# EAGLE design csa_netusb-v2.0b (EAGLE 5.11)

## Sheet 1 of 3
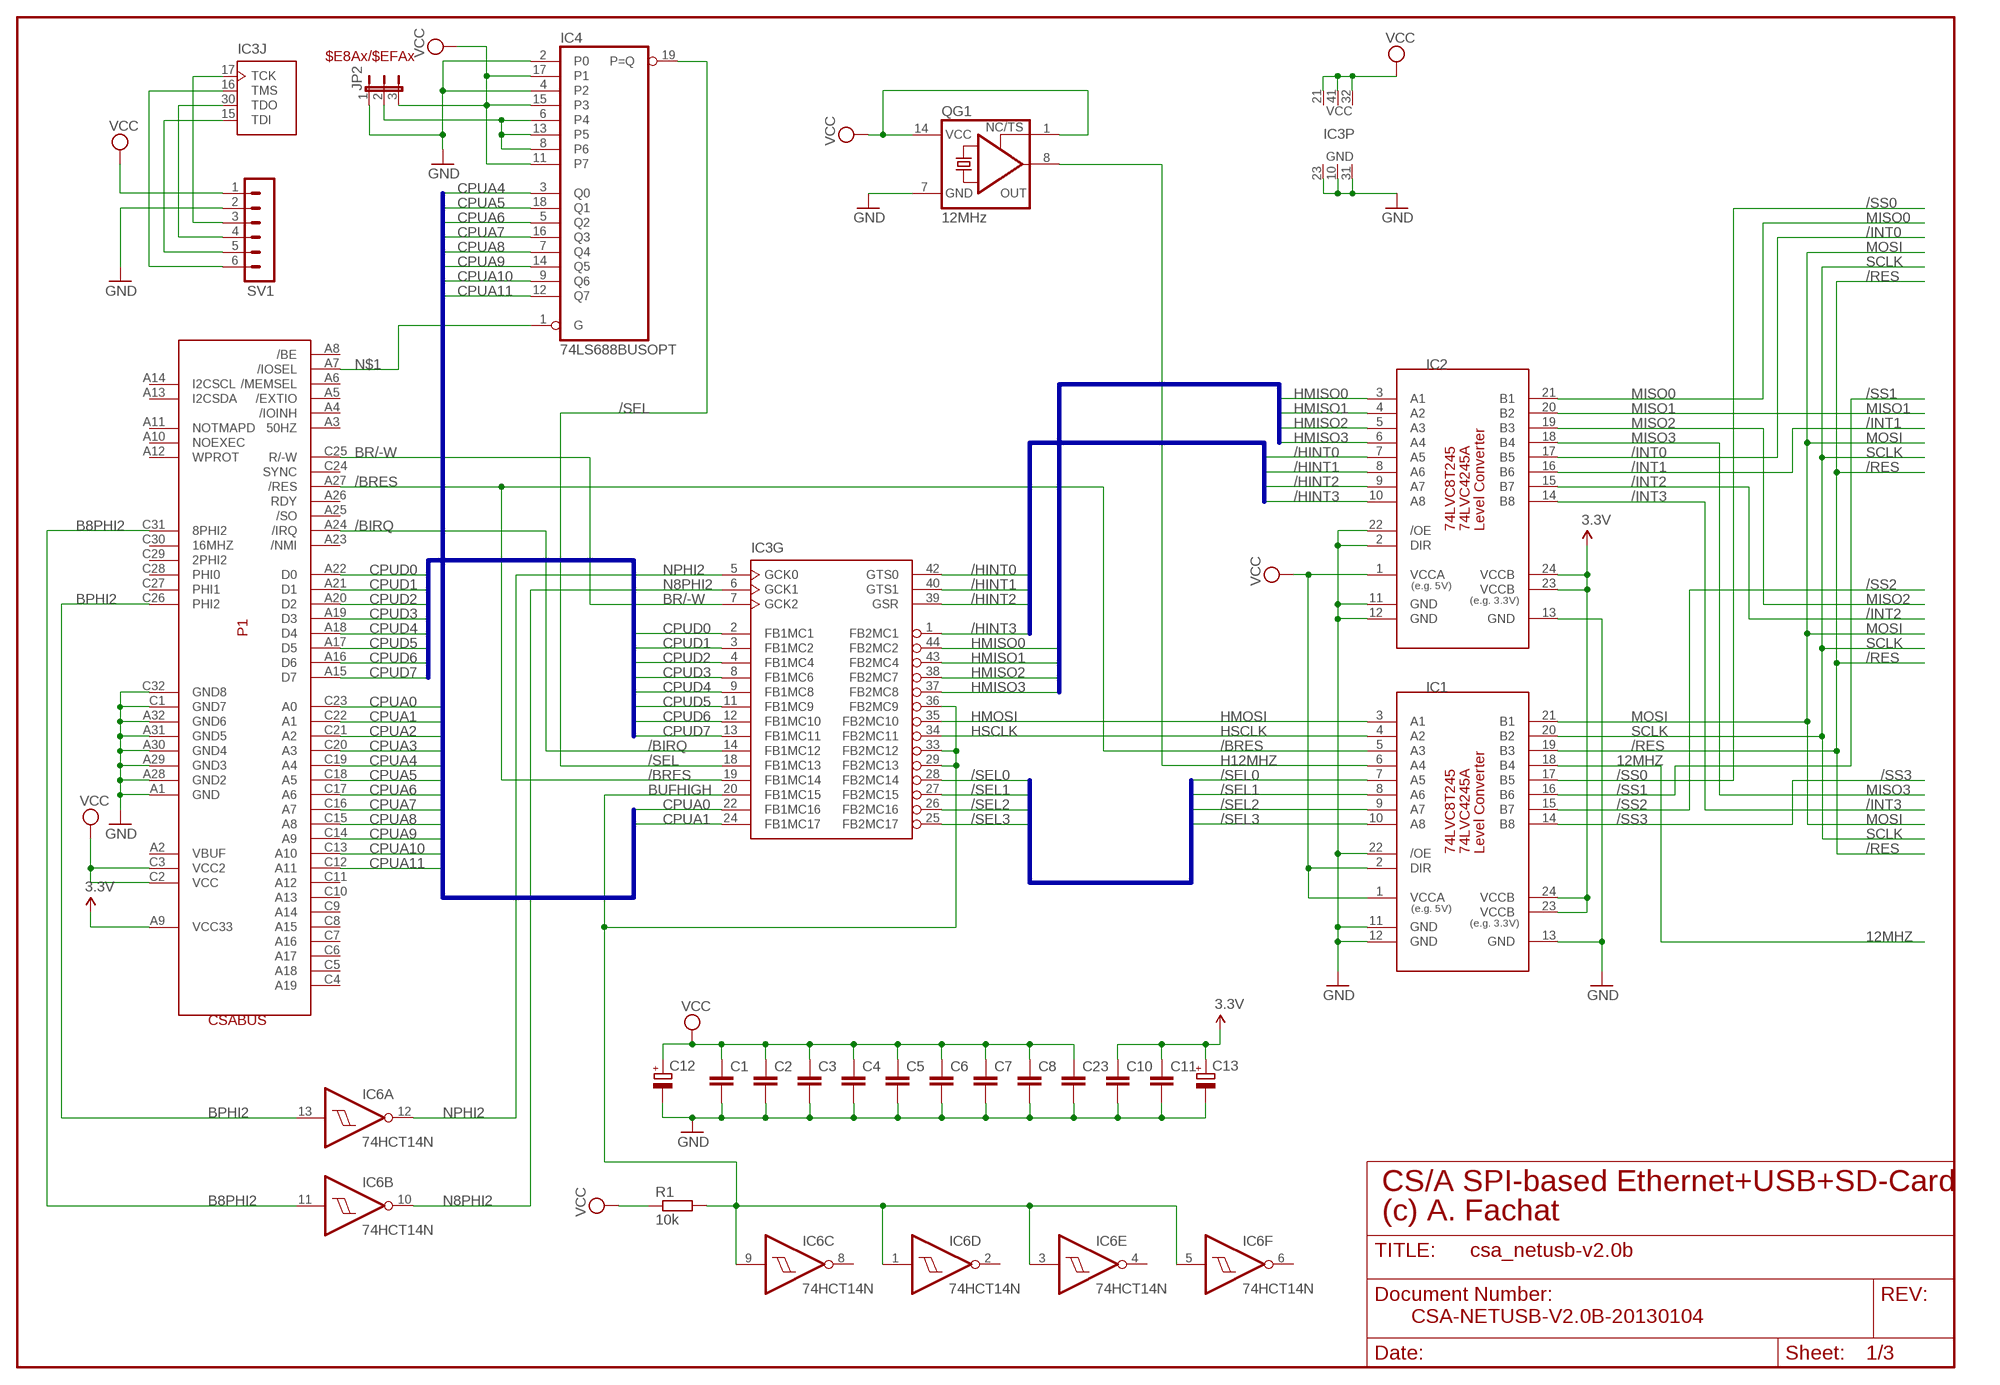
[diagram p0: schematic, sheet 1]

### Parts
C1  C-EU050-025X075  [C050-025X075]
C2  C-EU050-025X075  [C050-025X075]
C3  C-EU050-025X075  [C050-025X075]
C4  C-EU050-025X075  [C050-025X075]
C5  C-EU050-025X075  [C050-025X075]
C6  C-EU050-025X075  [C050-025X075]
C7  C-EU050-025X075  [C050-025X075]
C8  C-EU050-025X075  [C050-025X075]
C10  C-EU050-025X075  [C050-025X075]
C11  C-EU050-025X075  [C050-025X075]
C12  CPOL-EUE3.5-8  [E3,5-8]
C13  CPOL-EUE3.5-8  [E3,5-8]
C23  C-EU050-025X075  [C050-025X075]
IC1  74LVC8T245SO24  [SO24L]
IC2  74LVC8T245SO24  [SO24L]
IC3  XC9536-44  [PLCC-S44]
IC4  74LS688BUSOPT  [DIL20]
IC6  74HCT14N  [DIL14]
JP2  JP2E  [JP2]
P1  CSABUS  [CSABUS]
QG1  12MHz  XO-14  [DIL14S]
R1  10k  R-EU_0204/7  [0204/7]
SV1  MA06-1  [MA06-1]

### Nets
3.3V: C10.1 C11.1 C13.+ IC1.23(VCCB) IC1.24(VCCB) IC2.23(VCCB) IC2.24(VCCB) P1.A9(VCC33) ; also sheet 2,3
12MHZ: IC1.18(B4) ; also sheet 3
/BIRQ: IC3.14(G:FB1MC12) P1.A24(/IRQ)
/BRES: IC1.5(A3) IC3.19(G:FB1MC14) P1.A27(/RES)
/HINT0: IC2.7(A5) IC3.42(G:GTS0)
/HINT1: IC2.8(A6) IC3.40(G:GTS1)
/HINT2: IC2.9(A7) IC3.39(G:GSR)
/HINT3: IC2.10(A8) IC3.1(G:FB2MC1)
/INT0: IC2.17(B5) ; also sheet 2
/INT1: IC2.16(B6)
/INT2: IC2.15(B7) ; also sheet 3
/INT3: IC2.14(B8) ; also sheet 3
/RES: IC1.19(B3) ; also sheet 2,3
/SEL: IC3.18(G:FB1MC13) IC4.19(P=Q)
/SEL0: IC1.7(A5) IC3.28(G:FB2MC14)
/SEL1: IC1.8(A6) IC3.27(G:FB2MC15)
/SEL2: IC1.9(A7) IC3.26(G:FB2MC16)
/SEL3: IC1.10(A8) IC3.25(G:FB2MC17)
/SS0: IC1.17(B5) ; also sheet 2
/SS1: IC1.16(B6) ; also sheet 2
/SS2: IC1.15(B7) ; also sheet 3
/SS3: IC1.14(B8) ; also sheet 3
B8PHI2: IC6.11(B:I) P1.C31(8PHI2)
BPHI2: IC6.13(A:I) P1.C26(PHI2)
BR/-W: IC3.7(G:GCK2) P1.C25(R/-W)
BUFHIGH: IC3.20(G:FB1MC15) IC3.29(G:FB2MC13) IC3.33(G:FB2MC12) IC3.36(G:FB2MC9) IC6.1(D:I) IC6.3(E:I) IC6.5(F:I) IC6.9(C:I) R1.2
CPUA0: IC3.22(G:FB1MC16) P1.C23(A0)
CPUA1: IC3.24(G:FB1MC17) P1.C22(A1)
CPUA2: P1.C21(A2)
CPUA3: P1.C20(A3)
CPUA4: IC4.3(Q0) P1.C19(A4)
CPUA5: IC4.18(Q1) P1.C18(A5)
CPUA6: IC4.5(Q2) P1.C17(A6)
CPUA7: IC4.16(Q3) P1.C16(A7)
CPUA8: IC4.7(Q4) P1.C15(A8)
CPUA9: IC4.14(Q5) P1.C14(A9)
CPUA10: IC4.9(Q6) P1.C13(A10)
CPUA11: IC4.12(Q7) P1.C12(A11)
CPUD0: IC3.2(G:FB1MC1) P1.A22(D0)
CPUD1: IC3.3(G:FB1MC2) P1.A21(D1)
CPUD2: IC3.4(G:FB1MC4) P1.A20(D2)
CPUD3: IC3.8(G:FB1MC6) P1.A19(D3)
CPUD4: IC3.9(G:FB1MC8) P1.A18(D4)
CPUD5: IC3.11(G:FB1MC9) P1.A17(D5)
CPUD6: IC3.12(G:FB1MC10) P1.A16(D6)
CPUD7: IC3.13(G:FB1MC11) P1.A15(D7)
GND: C1.2 C2.2 C3.2 C4.2 C5.2 C6.2 C7.2 C8.2 C10.2 C11.2 C12.- C13.- C23.2 IC1.11(GND) IC1.12(GND) IC1.13(GND) IC1.22(/OE) IC2.2(DIR) IC2.11(GND) IC2.12(GND) IC2.13(GND) IC2.22(/OE) IC3.10(P:GND) IC3.23(P:GND) IC3.31(P:GND) IC4.2(P0) IC4.4(P2) JP2.1 P1.A1(GND) P1.A28(GND2) P1.A29(GND3) P1.A30(GND4) P1.A31(GND5) P1.A32(GND6) P1.C1(GND7) P1.C32(GND8) QG1.7(GND) SV1.2 ; also sheet 2,3
H12MHZ: IC1.6(A4) QG1.8(OUT)
HMISO0: IC2.3(A1) IC3.44(G:FB2MC2)
HMISO1: IC2.4(A2) IC3.43(G:FB2MC4)
HMISO2: IC2.5(A3) IC3.38(G:FB2MC7)
HMISO3: IC2.6(A4) IC3.37(G:FB2MC8)
HMOSI: IC1.3(A1) IC3.35(G:FB2MC10)
HSCLK: IC1.4(A2) IC3.34(G:FB2MC11)
MISO0: IC2.21(B1) ; also sheet 2
MISO1: IC2.20(B2) ; also sheet 2
MISO2: IC2.19(B3) ; also sheet 3
MISO3: IC2.18(B4) ; also sheet 3
MOSI: IC1.21(B1) ; also sheet 2,3
N8PHI2: IC3.6(G:GCK1) IC6.10(B:O)
N$1: IC4.1(G) P1.A7(/IOSEL)
N$15: IC4.6(P4) IC4.8(P6) IC4.13(P5) JP2.2
NPHI2: IC3.5(G:GCK0) IC6.12(A:O)
SCLK: IC1.20(B2) ; also sheet 2,3
TCK: IC3.17(J:TCK) SV1.3
TDI: IC3.15(J:TDI) SV1.5
TDO: IC3.30(J:TDO) SV1.4
TMS: IC3.16(J:TMS) SV1.6
VCC: C1.1 C2.1 C3.1 C4.1 C5.1 C6.1 C7.1 C8.1 C12.+ C23.1 IC1.1(VCCA) IC1.2(DIR) IC2.1(VCCA) IC3.21(P:VCC) IC3.32(P:VCC) IC3.41(P:VCC) IC4.11(P7) IC4.15(P3) IC4.17(P1) JP2.3 P1.C2(VCC) P1.C3(VCC2) QG1.1(TS) QG1.14(VCC) R1.1 SV1.1 ; also sheet 3
Unconnected: IC6.2(D:O) IC6.4(E:O) IC6.6(F:O) IC6.8(C:O) P1.A2(VBUF) P1.A3(50HZ) P1.A4(/IOINH) P1.A5(/EXTIO) P1.A6(/MEMSEL) P1.A8(/BE) P1.A10(NOEXEC) P1.A11(NOTMAPD) P1.A12(WPROT) P1.A13(I2CSDA) P1.A14(I2CSCL) P1.A23(/NMI) P1.A25(/SO) P1.A26(RDY) P1.C4(A19) P1.C5(A18) P1.C6(A17) P1.C7(A16) P1.C8(A15) P1.C9(A14) P1.C10(A13) P1.C11(A12) P1.C24(SYNC) P1.C27(PHI1) P1.C28(PHI0) P1.C29(2PHI2) P1.C30(16MHZ)

### Buses
HMISO[0..3]
/HINT[0..3]
/SEL[0..3]
CPUA[0..11]
CPUD[0..7]

### Notes on the sheet
- $E8Ax/$EFAx
- CS/A SPI-based Ethernet+USB+SD-Card
- (c) A. Fachat
- CSA-NETUSB-V2.0B-20130104

## Sheet 2 of 3
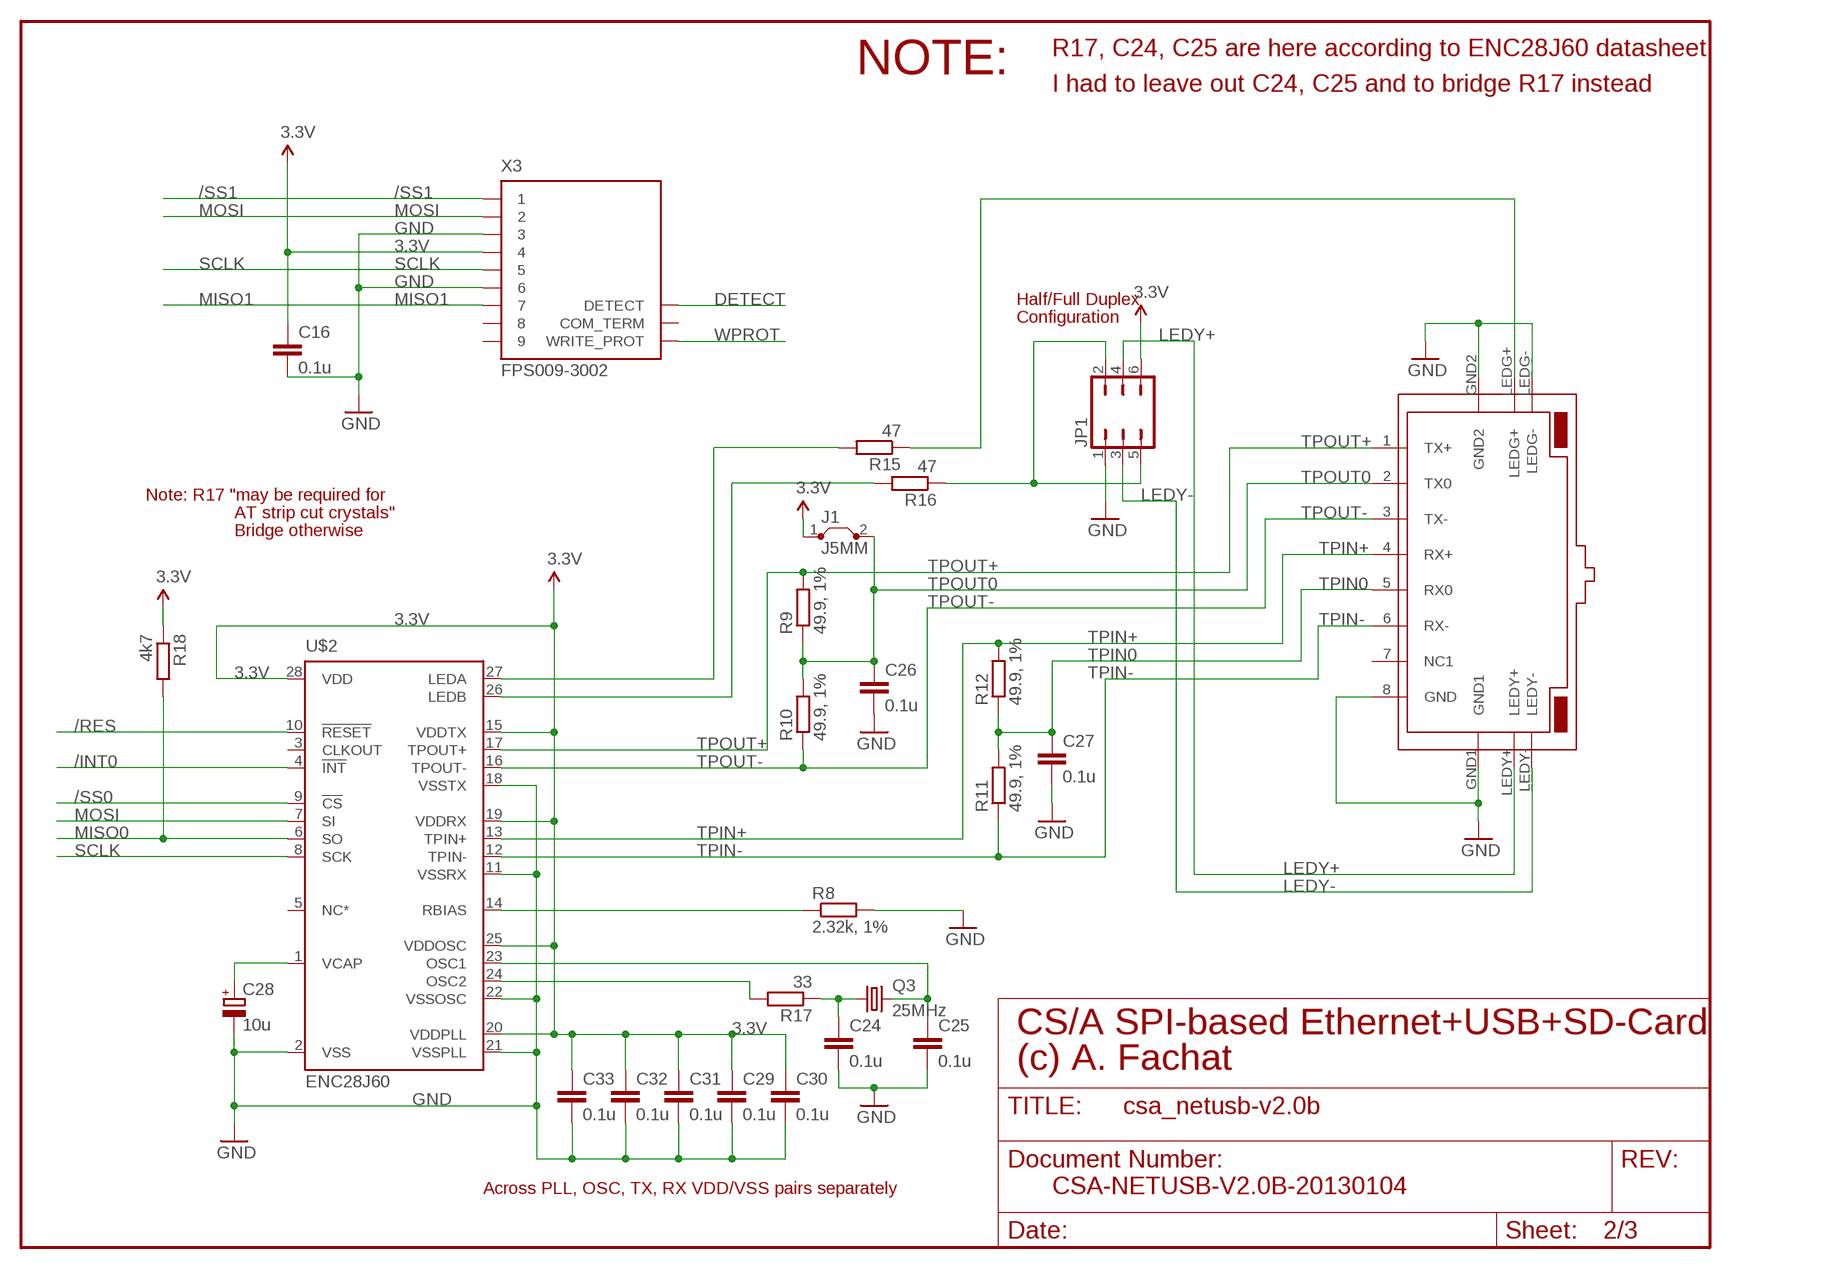
[diagram p1: schematic, sheet 2]

### Parts
C16  0.1u  C-EU050-025X075  [C050-025X075]
C24  0.1u  C-EU050-025X075  [C050-025X075]
C25  0.1u  C-EU050-025X075  [C050-025X075]
C26  0.1u  C-EU050-025X075  [C050-025X075]
C27  0.1u  C-EU050-025X075  [C050-025X075]
C28  10u  CPOL-EUE2-5  [E2-5]
C29  0.1u  C-EU050-025X075  [C050-025X075]
C30  0.1u  C-EU050-025X075  [C050-025X075]
C31  0.1u  C-EU025-025X050  [C025-025X050]
C32  0.1u  C-EU025-025X050  [C025-025X050]
C33  0.1u  C-EU025-025X050  [C025-025X050]
J1  J5MM  [05]
JP1  JP3Q  [JP3Q]
Q3  25MHz  CRYSTALHC49S  [HC49/S]
R8  2.32k, 1%  R-EU_0204/5  [0204/5]
R9  49.9, 1%  R-EU_0204/5  [0204/5]
R10  49.9, 1%  R-EU_0204/5  [0204/5]
R11  49.9, 1%  R-EU_0204/5  [0204/5]
R12  49.9, 1%  R-EU_0204/5  [0204/5]
R15  47  R-EU_0204/5  [0204/5]
R16  47  R-EU_0204/5  [0204/5]
R17  33  R-EU_0204/5  [0204/5]
R18  4k7  R-EU_0204/5  [0204/5]
U$2  ENC28J60  [DIP28-3]
U$3  RJ45-TRAFO-L  [RJ45-TRAFO-L]
X3  FPS009-3002  [FPS009-3000]

### Nets
3.3V: C16.1 C29.1 C30.1 C31.1 C32.1 C33.1 J1.1 JP1.6 R18.1 U$2.15(VDDTX) U$2.19(VDDRX) U$2.20(VDDPLL) U$2.25(VDDOSC) U$2.28(VDD) X3.4 ; also sheet 1,3
/INT0: U$2.4(!INT) ; also sheet 1
/RES: U$2.10(!RESET) ; also sheet 1,3
/SS0: U$2.9(!CS) ; also sheet 1
/SS1: X3.1 ; also sheet 1
DETECT: X3.DETECT ; also sheet 3
GND: C16.2 C24.2 C25.2 C26.2 C27.2 C28.- C29.2 C30.2 C31.2 C32.2 C33.2 JP1.1 R8.2 U$2.2(VSS) U$2.11(VSSRX) U$2.18(VSSTX) U$2.21(VSSPLL) U$2.22(VSSOSC) U$3.8(GND) U$3.GND1 U$3.GND2 U$3.LEDG- X3.3 X3.6 ; also sheet 1,3
LEDY+: JP1.4 U$3.LEDY+
LEDY-: JP1.3 U$3.LEDY-
MISO0: R18.2 U$2.6(SO) ; also sheet 1
MISO1: X3.7 ; also sheet 1
MOSI: U$2.7(SI) X3.2 ; also sheet 1,3
N$17: R15.2 U$2.27(LEDA)
N$18: R16.2 U$2.26(LEDB)
N$19: JP1.2 JP1.5 R16.1
N$20: C25.1 Q3.2 U$2.23(OSC1)
N$21: R17.2 U$2.24(OSC2)
N$22: C24.1 Q3.1 R17.1
N$23: R8.1 U$2.14(RBIAS)
N$30: C28.+ U$2.1(VCAP)
N$31: R15.1 U$3.LEDG+
SCLK: U$2.8(SCK) X3.5 ; also sheet 1,3
TPIN0: C27.1 R11.2 R12.1 U$3.5(RX0)
TPIN+: R12.2 U$2.13(TPIN+) U$3.4(RX+)
TPIN-: R11.1 U$2.12(TPIN-) U$3.6(RX-)
TPOUT0: C26.1 J1.2 R9.1 R10.2 U$3.2(TX0)
TPOUT+: R9.2 U$2.17(TPOUT+) U$3.1(TX+)
TPOUT-: R10.1 U$2.16(TPOUT-) U$3.3(TX-)
WPROT: X3.WRITE_PROT ; also sheet 3
Unconnected: U$2.3(CLKOUT) U$2.5(NC*) U$3.7(NC1) X3.8 X3.9 X3.COM_TERM

### Notes on the sheet
- R17, C24, C25 are here according to ENC28J60 datasheet
- NOTE:
- I had to leave out C24, C25 and to bridge R17 instead
- Half/Full Duplex
- Configuration
- Note: R17 "may be required for
- AT strip cut crystals"
- Bridge otherwise
- CS/A SPI-based Ethernet+USB+SD-Card
- (c) A. Fachat
- Across PLL, OSC, TX, RX VDD/VSS pairs separately | CSA-NETUSB-V2.0B-20130104

## Sheet 3 of 3
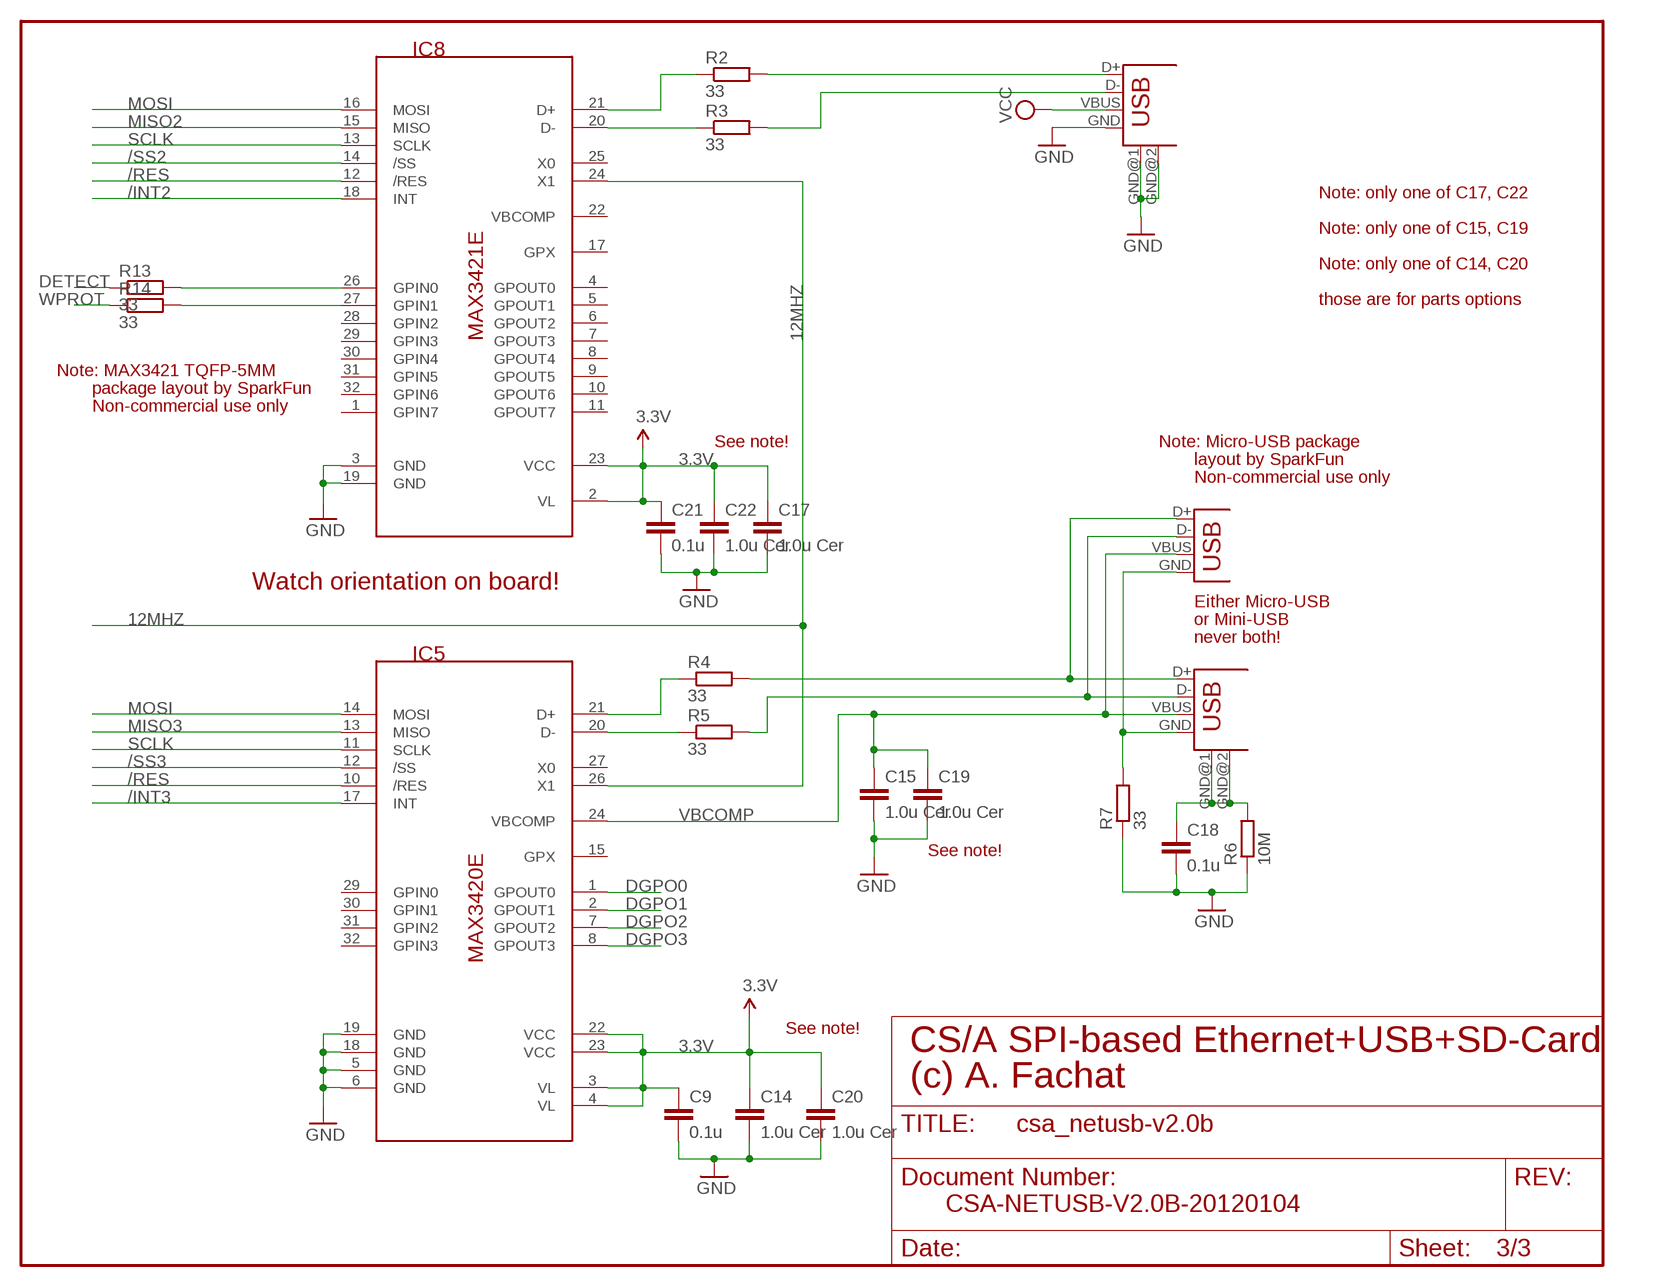
[diagram p2: schematic, sheet 3]

### Parts
C9  0.1u  C-EU050-025X075  [C050-025X075]
C14  1.0u Cer  C-EUC0603  [C0603]
C15  1.0u Cer  C-EUC0603  [C0603]
C17  1.0u Cer  C-EU050-024X044  [C050-024X044]
C18  0.1u  C-EU050-025X075  [C050-025X075]
C19  1.0u Cer  C-EU050-024X044  [C050-024X044]
C20  1.0u Cer  C-EU050-024X044  [C050-024X044]
C21  0.1u  C-EU050-025X075  [C050-025X075]
C22  1.0u Cer  C-EUC0603  [C0603]
IC5  MAX3420E  [LQFP32]
IC8  MAX3421E  [TQFP32-5MM]
R2  33  R-EU_0204/7  [0204/7]
R3  33  R-EU_0204/7  [0204/7]
R4  33  R-EU_0204/7  [0204/7]
R5  33  R-EU_0204/7  [0204/7]
R6  10M  R-EU_0204/7  [0204/7]
R7  33  R-EU_0204/7  [0204/7]
R13  33  R-EU_0204/7  [0204/7]
R14  33  R-EU_0204/7  [0204/7]
USB1  USB-A-H  [USB-A-H]
USB2  USB-MB-H  [USB-MB-H]
X1  USB-MICROB  [USB-MICROB]

### Nets
3.3V: C9.1 C14.1 C17.1 C20.1 C21.1 C22.1 IC5.3(VL) IC5.4(VL) IC5.22(VCC) IC5.23(VCC) IC8.2(VL) IC8.23(VCC) ; also sheet 1,2
12MHZ: IC5.26(X1) IC8.24(X1) ; also sheet 1
/INT2: IC8.18(INT) ; also sheet 1
/INT3: IC5.17(INT) ; also sheet 1
/RES: IC5.10(/RES) IC8.12(/RES) ; also sheet 1,2
/SS2: IC8.14(/SS) ; also sheet 1
/SS3: IC5.12(/SS) ; also sheet 1
DETECT: R13.1 ; also sheet 2
DGPO0: IC5.1(GPOUT0)
DGPO1: IC5.2(GPOUT1)
DGPO2: IC5.7(GPOUT2)
DGPO3: IC5.8(GPOUT3)
GND: C9.2 C14.2 C15.2 C17.2 C18.2 C19.2 C20.2 C21.2 C22.2 IC5.5(GND) IC5.6(GND) IC5.18(GND) IC5.19(GND) IC8.3(GND) IC8.19(GND) R6.1 R7.1 USB1.GND USB1.GND@1(GND) USB1.GND@2(GND) ; also sheet 1,2
MISO2: IC8.15(MISO) ; also sheet 1
MISO3: IC5.13(MISO) ; also sheet 1
MOSI: IC5.14(MOSI) IC8.16(MOSI) ; also sheet 1,2
N$3: IC8.20(D-) R3.1
N$4: IC8.21(D+) R2.1
N$5: IC5.20(D-) R5.1
N$6: IC5.21(D+) R4.1
N$7: R4.2 USB2.D+ X1.D+
N$8: R5.2 USB2.D- X1.D-
N$9: R2.2 USB1.D+
N$10: R3.2 USB1.D-
N$11: IC8.26(GPIN0) R13.2
N$13: R7.2 USB2.GND X1.GND
N$14: IC8.27(GPIN1) R14.2
N$16: C18.1 R6.2 USB2.GND@1(GND) USB2.GND@2(GND)
SCLK: IC5.11(SCLK) IC8.13(SCLK) ; also sheet 1,2
VBCOMP: C15.1 C19.1 IC5.24(VBCOMP) USB2.VBUS X1.VBUS
VCC: USB1.VBUS ; also sheet 1
WPROT: R14.1 ; also sheet 2
Unconnected: IC5.15(GPX) IC5.27(X0) IC5.29(GPIN0) IC5.30(GPIN1) IC5.31(GPIN2) IC5.32(GPIN3) IC8.1(GPIN7) IC8.4(GPOUT0) IC8.5(GPOUT1) IC8.6(GPOUT2) IC8.7(GPOUT3) IC8.8(GPOUT4) IC8.9(GPOUT5) IC8.10(GPOUT6) IC8.11(GPOUT7) IC8.17(GPX) IC8.22(VBCOMP) IC8.25(X0) IC8.28(GPIN2) IC8.29(GPIN3) IC8.30(GPIN4) IC8.31(GPIN5) IC8.32(GPIN6)

### Notes on the sheet
- Note: only one of C17, C22
- Note: only one of C15, C19
- Note: only one of C14, C20
- those are for parts options
- Note: MAX3421 TQFP-5MM
- package layout by SparkFun
- Non-commercial use only
- See note! | Note: Micro-USB package
- layout by SparkFun
- Non-commercial use only
- Watch orientation on board!
- Either Micro-USB
- or Mini-USB
- never both!
- See note!
- See note!
- CS/A SPI-based Ethernet+USB+SD-Card
- (c) A. Fachat
- CSA-NETUSB-V2.0B-20120104

## Power pins joined to a net without a drawn wire
GND: IC4.10(GND) IC6.7(P:GND)
VCC: IC4.20(VCC) IC6.14(P:VCC)

## Library data of the parts
C1-C11 C14-C27 C29-C33 = rcl:C-EU: CAPACITOR, European symbol
C12 C13 = resistor:CPOL-EU: POLARIZED CAPACITOR, European symbol
C28 = rcl:CPOL-EU: POLARIZED CAPACITOR, European symbol
IC1 IC2 = csa:74LVC8T245
IC3 = XILINX:XC9536-44
IC4 = csa:74LS688BUSOPT
IC5 = csa:MAX3420E
IC6 = 74xx-eu:74*14: Hex schmitt trigger INVERTER
IC8 = csa:MAX3421E
J1 = jumper:J: Bridge
JP1 = jumper:JP3Q: JUMPER
JP2 = jumper:JP2E: JUMPER
P1 = csa:CSABUS
Q3 = crystal:CRYSTAL: CRYSTAL; OC_FARNELL: 1667008; OC_NEWARK: unknown
QG1 = crystal:XO-: CRYSTAL; OC_FARNELL: unknown; OC_NEWARK: unknown
R1-R18 = rcl:R-EU_: RESISTOR, European symbol
SV1 = con-lstb:MA06-1: PIN HEADER
U$2 = csa:ENC28J60
U$3 = con-amphenol-rj45-ld:RJ45-TRAFO-L: RJ45 socket with integrated magnetics and LEDs Naming: Amphenol LMJ1998824110DL1T39J TME RJ45-TRAFO-L Author: Petr Kalandra <mailto:kalandrap@gmail.com> Datasheet: http://zefiryn.tme.pl/dok/zlacza/rjtrafol.PDF
USB1 USB2 = con-usb-2:USB: USB Connectors USB-B-PTH is fully proven SKU : PRT-00139 USB-miniB is fully proven SKU : PRT-00587 USB-A-PCB is untested. USB-A-H is throughly reviewed, but untested. Spark Fun Electronics SKU : PRT-00437 USB-B-SMT is throughly reviewed, but untested. Needs silkscreen touching up. USB-A-S has not been used/tested USB-MB-H has not been used/tested
X1 = SparkFun:USB: USB Connectors USB-B-PTH is fully proven SKU : PRT-00139 USB-miniB is fully proven SKU : PRT-00587 USB-A-PCB is untested. USB-A-H is throughly reviewed, but untested. Spark Fun Electronics SKU : PRT-00437 USB-B-SMT is throughly reviewed, but untested. Needs silkscreen touching up. USB-A-S has not been used/tested USB-MB-H has not been used/tested
X3 = con-yamaichi:FPS009-300*: SD Card and MMC Reader (Manual Insertion) Source: http://www.yamaichi.de/pdf/c_fps009_3000.pdf; OC_FARNELL: unknown; OC_NEWARK: unknown

## Board
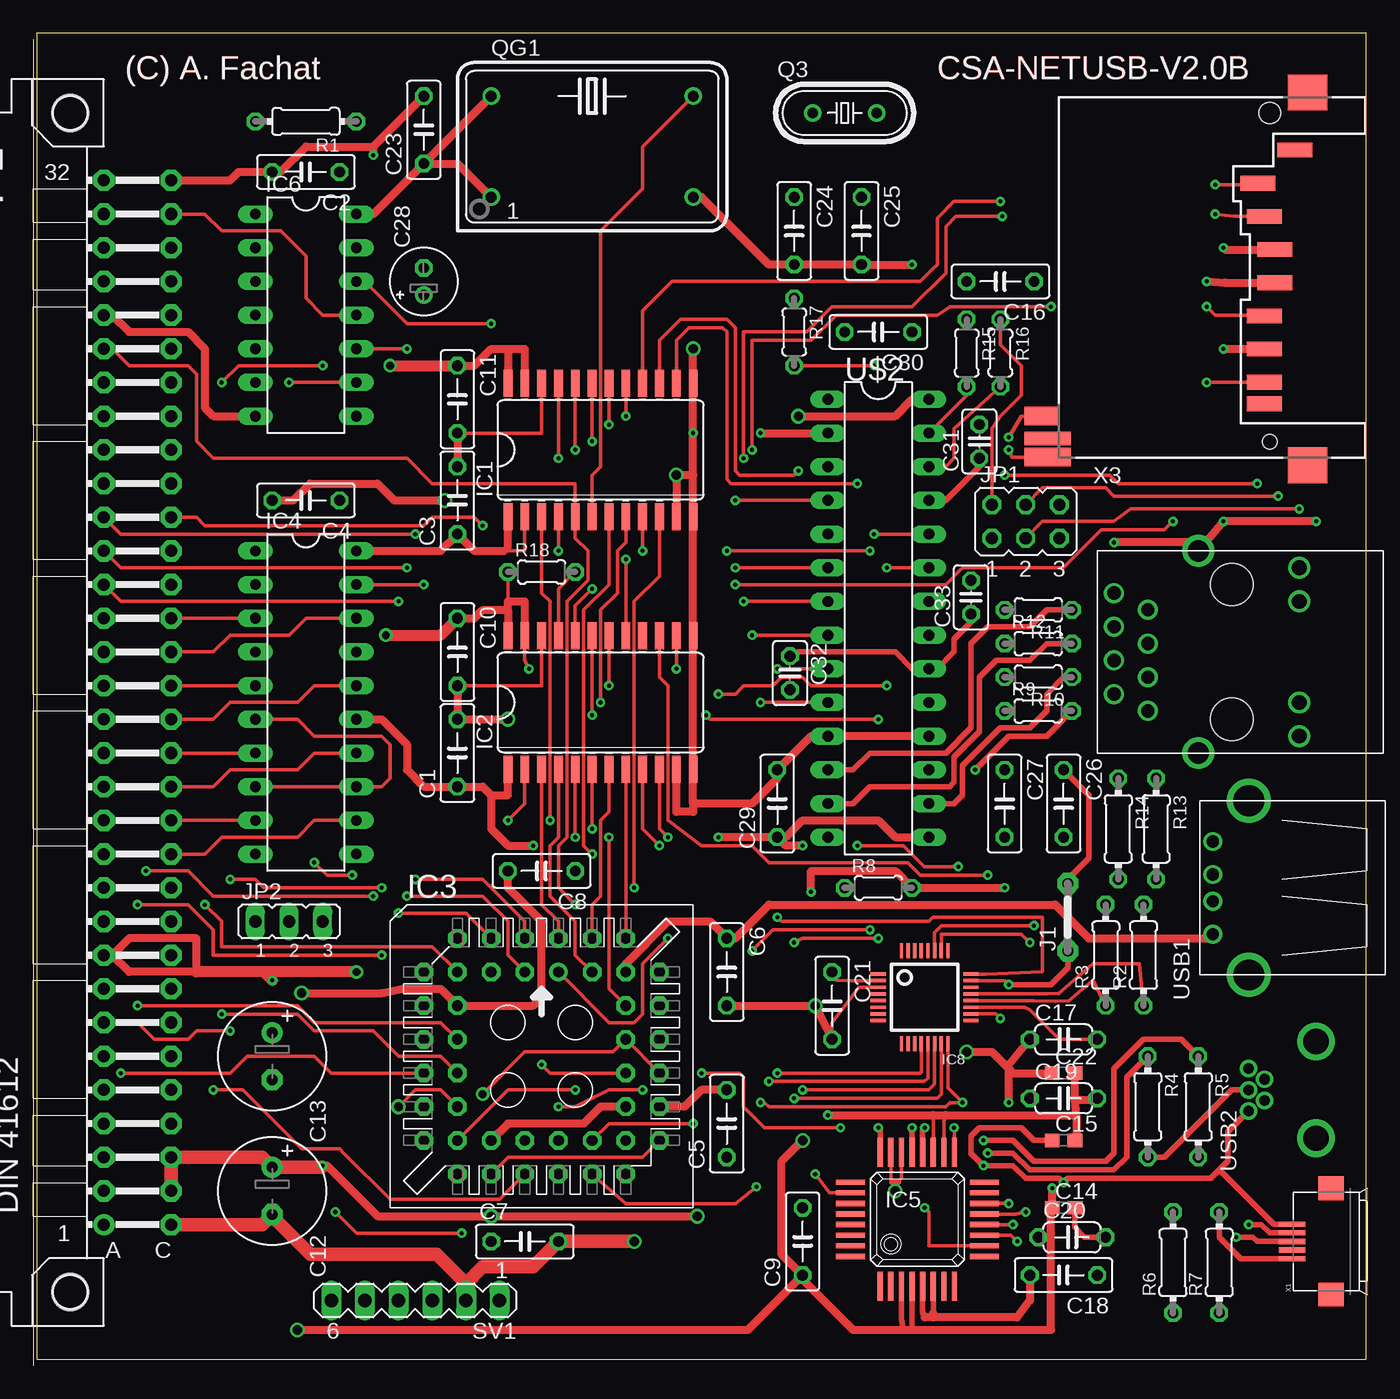
[diagram p3: board, top side]
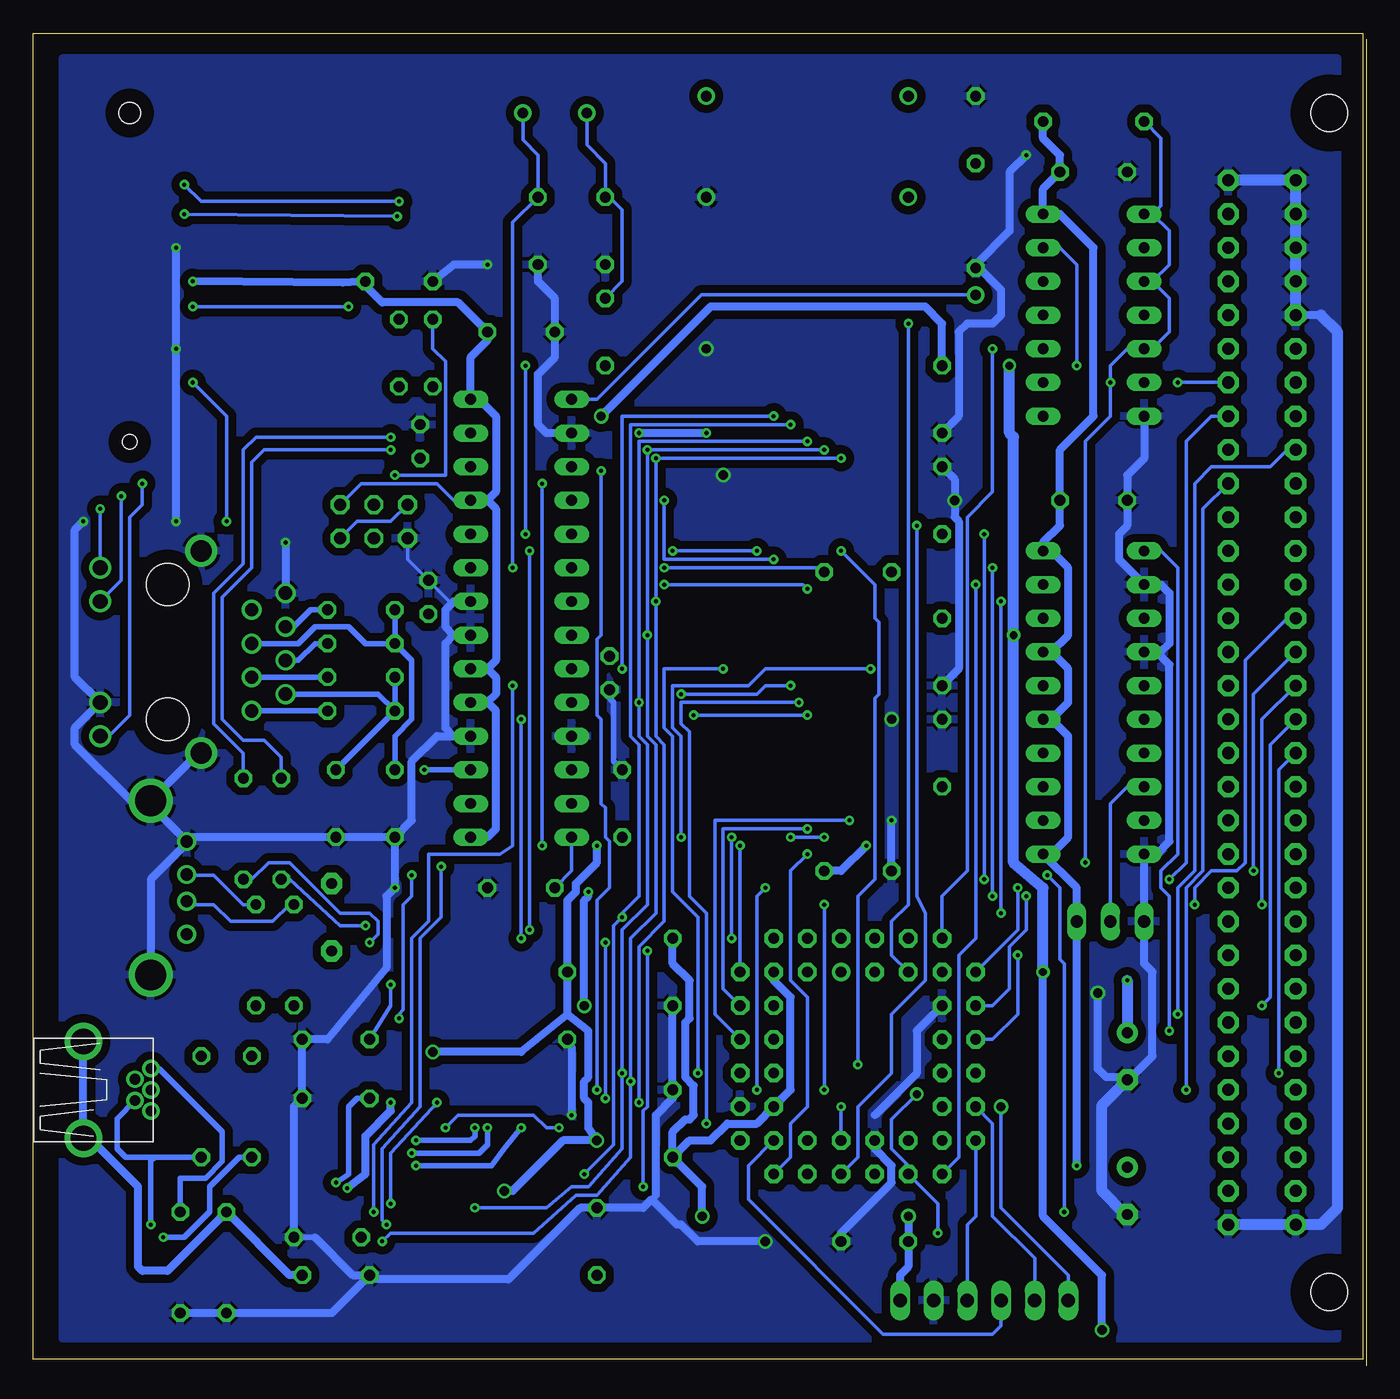
[diagram p4: board, bottom side, seen from below]

Size 100.31 x 100 mm. Coordinates in mm from the lower left corner, seen from the top.
Outline: 0,0 100.31,0 100.31,100 0,100 0,0
Copper layers (1*16): Top 0.035mm / dielectric 1.5mm / Bottom 0.035mm
Design rules "default *": minimum track width 10mil, minimum drill 12mil, track to track 6mil, track to pad 6mil, pad to pad 6mil, via to via 6mil, smd to smd 6mil, copper to edge 40mil, drill to drill 8mil, minimum pad ring 10mil, minimum via ring 8mil, stop-mask expansion 4mil, vias tented up to drill 0mil, thermal gap 10mil

### Footprints (pad centres in the part's own frame; a part is rotated, then mirrored left to right if it is on the bottom)
C050-025X075 = drill 0.813 octagon: 1 -2.54,0; 2 2.54,0
E3,5-8 = drill 0.813 pad 1.6 round: + -1.778,0 | drill 0.813 pad 1.6 octagon: - 1.778,0
C0603 = smd 1.1 x 1: 1 -0.85,0; 2 0.85,0
C050-024X044 = drill 0.813 octagon: 1 -2.54,0; 2 2.54,0
E2-5 = drill 0.813 pad 1.27 round: + -1.016,0 | drill 0.813 pad 1.27 octagon: - 1.016,0
C025-025X050 = drill 0.813 octagon: 1 -1.27,0; 2 1.27,0
SO24L = smd 0.66 x 2.032: 1 -3.81,-5.029; 2 -2.54,-5.029; 3 -1.27,-5.029; 4 0,-5.029; 5 1.27,-5.029; 6 2.54,-5.029; 7 3.81,-5.029; 8 5.08,-5.029; 9 6.35,-5.029; 10 7.62,-5.029; 11 8.89,-5.029; 12 10.16,-5.029; 13 10.16,5.029; 14 8.89,5.029; 15 7.62,5.029; 16 6.35,5.029; 17 5.08,5.029; 18 3.81,5.029; 19 2.54,5.029; 20 1.27,5.029; 21 0,5.029; 22 -1.27,5.029; 23 -2.54,5.029; 24 -3.81,5.029
PLCC-S44 = drill 0.813 pad 1.397 round: 1 1.27,6.35 | drill 0.813 pad 1.397 octagon: 2 -1.27,8.89; 3 -1.27,6.35; 4 -3.81,8.89; 5 -3.81,6.35; 6 -6.35,8.89; 7 -8.89,6.35; 8 -6.35,6.35; 9 -8.89,3.81; 10 -6.35,3.81; 11 -8.89,1.27; 12 -6.35,1.27; 13 -8.89,-1.27; 14 -6.35,-1.27; 15 -8.89,-3.81; 16 -6.35,-3.81; 17 -8.89,-6.35; 18 -6.35,-8.89; 19 -6.35,-6.35; 20 -3.81,-8.89; 21 -3.81,-6.35; 22 -1.27,-8.89; 23 -1.27,-6.35; 24 1.27,-8.89; 25 1.27,-6.35; 26 3.81,-8.89; 27 3.81,-6.35; 28 6.35,-8.89; 29 8.89,-6.35; 30 6.35,-6.35; 31 8.89,-3.81; 32 6.35,-3.81; 33 8.89,-1.27; 34 6.35,-1.27; 35 8.89,1.27; 36 6.35,1.27; 37 8.89,3.81; 38 6.35,3.81; 39 8.89,6.35; 40 6.35,8.89; 41 6.35,6.35; 42 3.81,8.89; 43 3.81,6.35; 44 1.27,8.89
DIL20 = drill 0.813 long: 1 -10.16,-3.81; 2 -7.62,-3.81; 3 -5.08,-3.81; 4 -2.54,-3.81; 5 0,-3.81; 6 2.54,-3.81; 7 5.08,-3.81; 8 7.62,-3.81; 9 10.16,-3.81; 10 12.7,-3.81; 11 12.7,3.81; 12 10.16,3.81; 13 7.62,3.81; 14 5.08,3.81; 15 2.54,3.81; 16 0,3.81; 17 -2.54,3.81; 18 -5.08,3.81; 19 -7.62,3.81; 20 -10.16,3.81
LQFP32 = smd 0.4 x 2.2: 1 -2.4,-4.65; 2 -1.6,-4.65; 3 -0.8,-4.65; 4 0,-4.65; 5 0.8,-4.65; 6 1.6,-4.65; 7 2.4,-4.65; 8 3.2,-4.65; 17 3.2,5.45; 18 2.4,5.45; 19 1.6,5.45; 20 0.8,5.45; 21 0,5.45; 22 -0.8,5.45; 23 -1.6,5.45; 24 -2.4,5.45 | smd 2.2 x 0.4: 9 5.45,-2.4; 10 5.45,-1.6; 11 5.45,-0.8; 12 5.45,0; 13 5.45,0.8; 14 5.45,1.6; 15 5.45,2.4; 16 5.45,3.2; 25 -4.65,3.2; 26 -4.65,2.4; 27 -4.65,1.6; 28 -4.65,0.8; 29 -4.65,0; 30 -4.65,-0.8; 31 -4.65,-1.6; 32 -4.65,-2.4
DIL14 = drill 0.813 long: 1 -7.62,-3.81; 2 -5.08,-3.81; 3 -2.54,-3.81; 4 0,-3.81; 5 2.54,-3.81; 6 5.08,-3.81; 7 7.62,-3.81; 8 7.62,3.81; 9 5.08,3.81; 10 2.54,3.81; 11 0,3.81; 12 -2.54,3.81; 13 -5.08,3.81; 14 -7.62,3.81
TQFP32-5MM = smd 1.143 x 0.254: 1 -3.5,1.75; 2 -3.5,1.25; 3 -3.5,0.75; 4 -3.5,0.25; 5 -3.5,-0.25; 6 -3.5,-0.75; 7 -3.5,-1.25; 8 -3.5,-1.75; 17 3.5,-1.75; 18 3.5,-1.25; 19 3.5,-0.75; 20 3.5,-0.25; 21 3.5,0.25; 22 3.5,0.75; 23 3.5,1.25; 24 3.5,1.75 | smd 0.254 x 1.143: 9 -1.75,-3.5; 10 -1.25,-3.5; 11 -0.75,-3.5; 12 -0.25,-3.5; 13 0.25,-3.5; 14 0.75,-3.5; 15 1.25,-3.5; 16 1.75,-3.5; 25 1.75,3.5; 26 1.25,3.5; 27 0.75,3.5; 28 0.25,3.5; 29 -0.25,3.5; 30 -0.75,3.5; 31 -1.25,3.5; 32 -1.75,3.5
05 = drill 0.813 pad 1.6 octagon: 1 -2.54,0; 2 2.54,0
JP3Q = drill 0.914 octagon: 1 -2.54,-1.27; 2 -2.54,1.27; 3 0,-1.27; 4 0,1.27; 5 2.54,-1.27; 6 2.54,1.27
JP2 = drill 0.914 long: 1 -2.54,0; 2 0,0; 3 2.54,0
CSABUS = drill 0.914 pad 1.6 round: A1 7.62,36.83 | drill 0.914 pad 1.6 octagon: A2 7.62,34.29; A3 7.62,31.75; A4 7.62,29.21; A5 7.62,26.67; A6 7.62,24.13; A7 7.62,21.59; A8 7.62,19.05; A9 7.62,16.51; A10 7.62,13.97; A11 7.62,11.43; A12 7.62,8.89; A13 7.62,6.35; A14 7.62,3.81; A15 7.62,1.27; A16 7.62,-1.27; A17 7.62,-3.81; A18 7.62,-6.35; A19 7.62,-8.89; A20 7.62,-11.43; A21 7.62,-13.97; A22 7.62,-16.51; A23 7.62,-19.05; A24 7.62,-21.59; A25 7.62,-24.13; A26 7.62,-26.67; A27 7.62,-29.21; A28 7.62,-31.75; A29 7.62,-34.29; A30 7.62,-36.83; A31 7.62,-39.37; A32 7.62,-41.91; C1 2.54,36.83; C2 2.54,34.29; C3 2.54,31.75; C4 2.54,29.21; C5 2.54,26.67; C6 2.54,24.13; C7 2.54,21.59; C8 2.54,19.05; C9 2.54,16.51; C10 2.54,13.97; C11 2.54,11.43; C12 2.54,8.89; C13 2.54,6.35; C14 2.54,3.81; C15 2.54,1.27; C16 2.54,-1.27; C17 2.54,-3.81; C18 2.54,-6.35; C19 2.54,-8.89; C20 2.54,-11.43; C21 2.54,-13.97; C22 2.54,-16.51; C23 2.54,-19.05; C24 2.54,-21.59; C25 2.54,-24.13; C26 2.54,-26.67; C27 2.54,-29.21; C28 2.54,-31.75; C29 2.54,-34.29; C30 2.54,-36.83; C31 2.54,-39.37; C32 2.54,-41.91 | hole 2.794: 10.16,41.91; 10.16,-46.99
HC49/S = drill 0.813 round: 1 -2.413,0; 2 2.413,0
DIL14S = drill 0.813 round: 1 -7.62,-3.81; 7 7.62,-3.81; 8 7.62,3.81; 14 -7.62,3.81
0204/7 = drill 0.813 octagon: 1 -3.81,0; 2 3.81,0
0204/5 = drill 0.813 octagon: 1 -2.54,0; 2 2.54,0
MA06-1 = drill 1.016 long: 1 -6.35,0; 2 -3.81,0; 3 -1.27,0; 4 1.27,0; 5 3.81,0; 6 6.35,0
DIP28-3 = drill 0.813 long: 1 -13.97,-3.81; 2 -11.43,-3.81; 3 -8.89,-3.81; 4 -6.35,-3.81; 5 -3.81,-3.81; 6 -1.27,-3.81; 7 1.27,-3.81; 8 3.81,-3.81; 9 6.35,-3.81; 10 8.89,-3.81; 11 11.43,-3.81; 12 13.97,-3.81; 13 16.51,-3.81; 14 19.05,-3.81; 15 19.05,3.81; 16 16.51,3.81; 17 13.97,3.81; 18 11.43,3.81; 19 8.89,3.81; 20 6.35,3.81; 21 3.81,3.81; 22 1.27,3.81; 23 -1.27,3.81; 24 -3.81,3.81; 25 -6.35,3.81; 26 -8.89,3.81; 27 -11.43,3.81; 28 -13.97,3.81
RJ45-TRAFO-L = drill 1 round: 1 -4.445,6.35; 2 -3.175,8.89; 3 -1.905,6.35; 4 -0.635,8.89; 5 0.635,6.35; 6 1.905,8.89; 7 3.175,6.35; 8 4.445,8.89 | drill 1.6 round: GND1 -7.62,2.54; GND2 7.62,2.54 | drill 1.1 round: LEDG+ -6.35,-5.08; LEDG- -3.81,-5.08; LEDY+ 3.81,-5.08; LEDY- 6.35,-5.08 | hole 3.2: -5.08,0; 5.08,0
USB-A-H = drill 0.914 round: D+ 2.718,-1.003; D- 2.718,1.003; GND 2.718,-3.493; VBUS 2.718,3.493 | drill 2.311 round: GND@1 0,6.566; GND@2 0,-6.566
USB-MB-H = drill 0.8 round: D+ 5.1,0; D- 3.9,0.8; GND 5.1,-1.6; ID 3.9,-0.8; VBUS 5.1,1.6 | drill 1.9 round: GND@1 0,3.65; GND@2 0,-3.65
USB-MICROB = smd 0.4 x 2: D+ 0,3.1; D- 0.65,3.1; GND -1.3,3.1; ID -0.65,3.1; VBUS 1.3,3.1 | smd 1.8 x 1.9: GND@2 -4,0.15; GND@3 4,0.15
FPS009-3000 = smd 2.65 x 1.1: 1 -0.915,-5.3; 2 -0.415,-7.8; 3 0.385,-10.3; 4 0.385,-12.8; 5 -0.415,-15.3; 6 -0.415,-17.8; 7 -0.415,-20.3; 8 -0.415,-21.925; 9 1.885,-2.8 | smd 3.5 x 1: COM_TERM -16.75,-24.55 | smd 2.5 x 1.4: DETECT -17.25,-22.85 | smd 3 x 2.7: M1 2.85,1.55; M2 2.85,-26.55 | smd 3.5 x 1.4: WRITE_PROT -16.75,-25.95 | hole 1.6: 0,0 | hole 1.1: 0,-24.8

### Placement (x,y rotation side)
C1  31.75,45.72 90 top
C2  20.32,89.53 180 top
C3  31.75,64.77 90 top
C4  20.32,64.77 180 top
C5  52.07,17.78 90 top
C6  52.07,29.21 270 top
C7  36.83,8.89 0 top
C8  38.1,36.83 180 top
C9  57.78,8.89 90 top
C10  31.75,53.34 270 top
C11  31.75,72.39 270 top
C12  17.78,12.7 270 top
C13  17.78,22.86 270 top
C14  77.47,11.43 0 top
C15  77.47,16.51 0 top
C16  72.71,81.28 180 top
C17  77.47,24.13 0 top
C18  77.47,6.35 180 top
C19  77.47,19.68 0 top
C20  78.11,9.21 0 top
C21  60.01,26.67 270 top
C22  77.47,21.59 0 top
C23  29.21,92.71 90 top
C24  57.15,85.09 270 top
C25  62.23,85.09 270 top
C26  77.47,41.91 270 top
C27  73.03,41.91 270 top
C28  29.21,81.28 90 top
C29  55.88,41.91 90 top
C30  63.5,77.47 180 top
C31  71.12,69.22 90 top
C32  56.83,51.75 270 top
C33  70.48,57.47 90 top
IC1  39.37,68.58 0 top
IC2  39.37,49.53 0 top
IC3  38.1,22.86 0 top
IC4  20.32,50.8 270 top
IC5  66.04,10.16 0 top
IC6  20.32,78.74 270 top
IC8  66.99,27.3 0 top
J1  77.79,33.34 90 top
JP1  74.61,63.18 0 top
JP2  19.05,33.02 0 top
P1  12.7,46.99 180 top
Q3  60.96,93.98 0 top
QG1  41.91,91.44 0 top
R1  20.32,93.34 180 top
R2  83.5,30.48 90 top
R3  80.64,30.48 90 top
R4  83.82,19.05 270 top
R5  87.63,19.05 270 top
R6  85.72,7.3 90 top
R7  89.22,7.3 90 top
R8  63.5,35.56 0 top
R9  75.56,48.9 0 top
R10  75.56,51.44 180 top
R11  75.56,56.52 180 top
R12  75.56,53.98 0 top
R13  84.45,40.01 270 top
R14  81.6,40.01 270 top
R15  70.17,75.88 270 top
R16  72.71,75.88 270 top
R17  57.15,77.47 270 top
R18  38.1,59.37 0 top
SV1  28.57,4.45 180 top
U$2  63.5,58.42 270 top
U$3  90.17,53.34 90 top
USB1  91.44,35.56 180 top
USB2  96.52,20.32 180 top
X1  97.79,8.89 90 top
X3  93.03,93.98 0 top

### Tracks (layer width: path | path; a pad name or v marks a point on that pad's centre or on a via)
3.3V  (via drill 0.3, 0.6, 0.7)
  Top 0.254: IC2.23 36.83,52.7 v37.15,52.07 | IC8.2 61.3,28.55 60.33,28.57 60.33,28.89 C21.1 | IC5.22 65.24,13.65 65.09,13.5 65.09,13.34 64.77,13.34 64.45,13.34 64.44,13.35 IC5.23 | 76.52,9.53 76.2,9.21 | 76.52,11.43 C14.1 | IC8.23 73.05,28.55 v73.34,28.26 | 35.56,57.15 R18.1
  Top 0.406: IC5.3 65.24,3.01 65.41,2.22 | 66.04,2.22 IC5.4 | C33.1 70.48,55.56 69.22,54.29 69.22,53.34 67.94,52.07 U$2.20 66.04,52.07 64.77,53.34 57.47,53.34 57.15,53.02 C32.1 | C31.1 71.12,67.31 68.58,64.77 U$2.25 | J1.1 77.79,29.53 76.52,28.26 v73.34,28.26
  Top 0.61: 5.71,30.48 P1.A9 | 5.71,30.48 6.99,31.75 12.06,31.75 12.06,29.21 6.99,29.21 5.71,30.48 | IC2.23 36.83,57.15 35.56,57.15 35.56,56.52 | 35.56,56.52 IC2.24 | C10.1 33.02,55.88 33.66,56.52 35.56,56.52 | C11.1 33.02,74.93 34.29,76.2 35.56,76.2 | 35.56,76.2 IC1.24 | IC1.23 36.83,76.2 35.56,76.2 | C29.1 v51.44,39.37 | C29.1 56.52,39.37 57.78,40.64 63.5,40.64 64.77,39.37 U$2.15 | v57.78,38.73 56.52,38.73 C29.1 | v88.27,81.28 89.64,81.18 X3.4 | C14.1 v76.62,12.91 | C9.1 57.78,6.03 61.59,2.22 65.41,2.22 66.04,2.22 76.52,2.22 76.52,9.53 76.52,11.43 | 76.2,9.21 C20.1 | v57.47,71.12 64.77,71.12 66.04,72.39 U$2.28 | v19.68,2.22 53.66,2.22 C9.1 | v57.78,16.51 56.2,14.92 56.2,7.94 C9.1 | v64.77,12.7 64.77,13.34 | v70.17,23.18 72.07,23.18 73.34,21.91 | v73.34,19.37 73.34,21.91 | C17.1 73.34,22.23 73.34,21.91 | C22.1 73.66,21.59 73.34,21.91
  Top 0.813: 17.14,29.21 12.06,29.21 | 17.14,29.21 v17.78,28.57 | v24.13,29.21 17.14,29.21 | v26.35,54.61 30.48,54.61 C10.1 | v26.67,74.93 C11.1
  Bottom 0.254: v37.15,52.07 45.09,52.07 46.35,50.8 52.07,50.8 52.07,47.62 51.44,46.99 v51.44,39.37 | U$2.28 66.67,72.39 | v73.34,28.26 73.34,26.67 C17.1 | U$2.25 68.58,64.77 69.85,66.04 75.56,66.04 JP1.6
  Bottom 0.61: v57.78,38.73 57.78,37.47 59.37,35.88 59.37,35.24 60.01,34.61 C21.1 60.01,26.04 | v88.27,81.28 76.94,81.18 C16.1 75.25,80.96 73.98,79.69 68.26,79.69 C30.1 66.04,76.83 67.31,75.56 U$2.28 | 66.67,72.39 65.41,71.12 65.41,65.41 66.04,64.77 | 66.04,64.77 U$2.25 | 66.04,64.77 65.41,64.14 65.41,52.7 66.04,52.07 | 66.04,52.07 U$2.20 | 66.04,52.07 65.41,51.44 65.41,50.16 66.04,49.53 | 66.04,49.53 U$2.19 | 66.04,49.53 65.41,48.9 65.41,40.01 66.04,39.37 U$2.15 | v76.62,12.91 75.25,13.97 75.25,16.83 73.34,18.73 v73.34,19.37 | C11.1 31.75,78.11 33.02,79.38 49.21,79.38 v57.47,71.12 | v24.13,29.21 24.13,10.79 19.68,6.35 v19.68,2.22 | 60.01,26.04 58.42,24.77 58.42,21.27 58.74,20.95 58.74,19.68 58.42,19.37 58.42,17.46 v57.78,16.51 | v57.78,16.51 57.78,16.83 | v57.78,16.51 60.33,16.51 64.14,12.7 v64.77,12.7 | 60.01,26.04 63.5,23.18 v70.17,23.18
  Bottom 0.813: v17.78,28.57 C13.+ | v24.13,29.21 24.13,35.56 26.35,37.47 v26.35,54.61 26.35,69.53 26.67,69.85 v26.67,74.93
12MHZ  (via drill 0.3)
  Top 0.254: v43.18,70.48 IC1.18 | IC8.24 71.6,29.05 75.88,29.21 75.88,33.34 67.63,33.34 67.31,33.02 56.2,33.02 v55.88,33.34 | IC5.26 59.83,12.56 v58.74,13.97
  Bottom 0.254: v43.18,70.48 55.24,70.48 55.24,46.99 54.61,46.35 54.61,34.92 55.88,33.66 v55.88,33.34 56.52,32.7 56.52,16.19 v58.74,13.97
/BIRQ  (via drill 0.3)
  Top 0.254: v13.97,26.04 19.68,26.04 20.95,24.77 25.4,24.77 27.3,22.86 30.48,22.86 IC3.14
  Bottom 0.254: P1.A24 5.71,68.58 6.99,67.31 11.43,67.31 12.7,66.04 12.7,36.83 13.97,35.56 v13.97,26.04
/BRES  (via drill 0.3)
  Top 0.254: P1.A27 5.71,76.2 6.99,74.93 11.43,74.93 12.06,74.3 12.06,69.22 13.34,67.94 27.94,67.94 29.84,66.04 40.64,66.04 IC1.5 40.64,61.91 41.59,60.96 41.59,58.74 40.01,57.15 40.01,39.37 39.37,38.73 39.37,35.56 v40.64,34.29 | v40.64,20.32 35.56,20.32 IC3.19
  Bottom 0.254: v40.64,20.32 v40.64,34.29
/HINT0
  Top 0.254: IC2.7 43.18,41.27 42.55,40.64 42.55,34.92 41.91,34.29 IC3.42
/HINT1
  Top 0.254: IC3.40 IC2.8
/HINT2  (via drill 0.3)
  Top 0.254: IC2.9 45.72,40.01 v46.99,38.73
  Bottom 0.254: IC3.39 v46.99,38.73
/HINT3  (via drill 0.3)
  Top 0.254: IC2.10 46.99,40.01 v47.62,39.37 | v47.62,31.75 45.72,29.84 45.72,26.04 45.09,25.4 43.18,25.4 IC3.1
  Bottom 0.254: v47.62,31.75 v47.62,39.37
/INT0  (via drill 0.3)
  Top 0.254: IC2.17 v44.45,60.33 | v52.7,64.77 U$2.4
  Bottom 0.254: v44.45,60.33 52.7,60.33 v52.7,64.77
/INT2  (via drill 0.3)
  Top 0.254: IC2.15 46.99,51.44 47.62,50.8 47.62,40.64 50.16,38.73 53.98,38.73 55.24,37.47 65.72,37.47 66.67,36.51 v71.75,36.51 | IC8.18 72.37,26.05 v72.71,25.72
  Bottom 0.254: v72.71,25.72 72.71,26.04 72.39,26.35 72.39,34.29 71.75,34.92 v71.75,36.51
/INT3  (via drill 0.3)
  Top 0.254: v48.26,52.07 IC2.14 | IC5.17 69.24,17.44 v69.22,17.46 | v60.64,17.46 54.93,17.46 53.34,19.05 53.34,21.27 53.02,21.59 v50.16,21.59
  Bottom 0.254: v48.26,52.07 52.7,52.07 52.7,47.62 52.07,46.99 52.07,35.24 50.16,33.34 v50.16,21.59 | v69.22,17.46 68.26,18.41 62.55,18.41 61.59,17.46 v60.64,17.46
/RES  (via drill 0.3)
  Top 0.254: v41.91,69.22 IC1.19 | v54.61,49.53 U$2.10 | IC8.12 66.74,21.66 66.67,21.59 v55.88,21.59 | IC5.10 67.32,8.56 67.31,8.57 67.31,11.11 v66.99,11.43
  Bottom 0.254: v41.91,69.22 54.61,69.22 v54.61,49.53 54.61,46.99 53.98,46.35 53.98,34.29 55.88,32.38 v55.88,21.59 55.88,15.88 58.42,13.02 59.69,13.02 61.59,11.43 v66.99,11.43
/SEL  (via drill 0.3)
  Top 0.254: v29.21,58.42 IC4.19
  Bottom 0.254: v29.21,58.42 29.21,31.75 30.48,30.48 30.48,15.24 IC3.18
/SEL0  (via drill 0.3)
  Top 0.254: IC1.7 43.18,58.42 41.27,56.52 41.27,38.73 v41.91,38.1
  Bottom 0.254: v41.91,38.1 43.18,36.83 43.18,28.57 41.91,27.3 41.91,19.05 43.18,17.78 43.18,15.24 IC3.28
/SEL1  (via drill 0.3)
  Top 0.254: IC1.8 44.45,61.59 43.81,60.96 43.81,57.78 42.55,56.52 v42.55,49.53 | v49.53,17.78 43.18,17.78 IC3.27
  Bottom 0.254: v42.55,49.53 51.44,49.53 51.44,47.94 50.8,47.31 50.8,34.92 49.53,33.66 v49.53,17.78
/SEL2  (via drill 0.3)
  Top 0.254: v45.72,60.96 IC1.9 | v62.87,60.96 v52.07,60.96 | IC3.26 44.45,11.75 52.7,11.75 v54.29,13.02 | v53.98,30.8 55.56,32.38 v62.87,32.38
  Bottom 0.254: v52.07,60.96 v45.72,60.96 | v54.29,13.02 54.29,18.73 53.98,19.05 v53.98,30.8 | v62.87,32.38 v62.87,60.96
/SEL3  (via drill 0.3)
  Top 0.254: IC1.10 46.99,59.05 45.09,57.15 v45.09,35.56 | v45.72,20.32 43.18,20.32 40.64,19.05 v39.37,19.05
  Bottom 0.254: v45.09,35.56 45.72,34.92 v45.72,20.32 | IC3.25 v39.37,19.05
/SS0  (via drill 0.3)
  Top 0.254: v44.45,71.12 IC1.17 | v55.88,52.07 U$2.9
  Bottom 0.254: v44.45,71.12 55.88,71.12 v55.88,52.07
/SS1  (via drill 0.3)
  Top 0.254: IC1.16 45.72,79.06 47.94,81.28 66.67,81.28 67.63,82.23 67.94,82.55 67.94,86.04 69.22,87.31 v72.71,87.31 | v88.9,88.58 92.02,88.58 X3.1
  Bottom 0.254: v72.71,87.31 87.63,87.31 v88.9,88.58
/SS2  (via drill 0.3)
  Top 0.254: IC1.15 46.99,76.83 48.58,78.42 52.07,78.42 52.7,77.79 52.7,66.99 53.02,66.67 57.15,66.67 v57.47,66.99 | IC8.14 67.74,20.75 67.31,20.32 v57.78,20.32
  Bottom 0.254: v57.78,20.32 57.78,34.61 56.83,35.56 56.83,39.05 57.15,39.37 57.15,41.59 57.47,41.91 57.47,48.26 57.78,48.58 57.78,54.29 57.47,54.61 v57.47,66.99
/SS3  (via drill 0.3)
  Top 0.254: IC1.14 48.26,76.83 49.21,77.79 51.75,77.79 52.07,77.47 52.07,66.36 52.39,66.04 v61.91,66.04 | v61.91,38.73 65.41,38.73 66.99,37.15 v69.53,37.15 | IC5.12 v73.66,10.16
  Bottom 0.254: v61.91,38.73 v61.91,66.04 | v69.53,37.15 69.53,33.34 71.12,31.75 71.12,19.05 73.98,15.88 73.98,10.48 v73.66,10.16
B8PHI2
  Top 0.254: P1.C31 12.7,86.36 13.97,85.09 18.41,85.09 20.32,83.19 20.32,80.01 21.59,78.74 IC6.11
BPHI2  (via drill 0.3)
  Top 0.254: v13.97,73.66 15.24,74.93 v21.59,74.93
  Bottom 0.254: P1.C26 v13.97,73.66 | v21.59,74.93 21.59,82.55 22.86,83.82 IC6.13
BR/-W  (via drill 0.3)
  Top 0.254: v14.61,36.2 16.51,36.2 17.14,35.56 v26.04,35.56
  Bottom 0.254: P1.C25 11.43,71.12 13.34,69.22 13.34,37.47 v14.61,36.2 | v26.04,35.56 26.04,32.38 IC3.7
BUFHIGH  (via drill 0.3, 0.6)
  Top 0.254: v19.05,73.66 IC6.9 | v32.07,9.53 24.13,9.53 v22.54,11.11 | v23.81,36.51 21.91,36.51 v20.95,37.47 | IC3.20 35.56,15.24 45.72,15.24 IC3.29 | IC3.33 IC3.36 43.5,23.18 36.83,23.18 v33.66,20
  Bottom 0.254: 15.88,81.28 14.61,80.01 14.61,77.47 15.88,76.2 IC6.5 17.78,76.2 19.05,74.93 v19.05,73.66 19.05,71.12 20.95,69.22 v20.95,37.47 | 15.88,81.28 IC6.3 | 15.88,81.28 14.61,82.55 14.61,85.09 15.88,86.36 | 15.88,86.36 IC6.1 | 15.88,86.36 15.24,87 15.24,92.08 R1.2 | v32.07,9.53 32.07,11.75 IC3.20 34.29,14.61 35.56,15.88 35.56,18.1 v33.66,20 | v22.54,11.11 22.54,29.84 22.86,30.16 22.86,35.56 v23.81,36.51
CPUA0  (via drill 0.3)
  Top 0.254: v13.34,20.32 15.56,20.32 20,15.88 22.86,15.88 23.18,15.56 26.67,12.06 34.92,12.06 IC3.22
  Bottom 0.254: P1.C23 12.06,64.14 12.06,36.83 13.34,35.56 v13.34,20.32
CPUA1  (via drill 0.3)
  Top 0.254: P1.C22 12.06,63.5 12.7,62.87 29.21,62.87 29.84,63.5 33.02,63.5 v33.66,62.87
  Bottom 0.254: v33.66,62.87 33.66,34.92 33.02,33.66 33.02,28.57 35.56,26.04 35.56,21.59 38.1,19.05 38.1,15.24 IC3.24
CPUA4
  Top 0.254: P1.C19 IC4.3
CPUA5
  Top 0.254: P1.C18 13.34,53.34 14.61,54.61 19.05,54.61 20.32,55.88 IC4.18
CPUA6
  Top 0.254: P1.C17 IC4.5
CPUA7
  Top 0.254: P1.C16 13.34,48.26 14.61,49.53 19.68,49.53 20.95,50.8 IC4.16
CPUA8
  Top 0.254: P1.C15 IC4.7
CPUA9
  Top 0.254: P1.C14 13.34,43.18 14.61,44.45 19.68,44.45 20.95,45.72 IC4.14
CPUA10
  Top 0.254: P1.C13 IC4.9
CPUA11
  Top 0.254: P1.C12 12.7,38.1 13.97,39.37 19.68,39.37 20.95,40.64 IC4.12
CPUD0  (via drill 0.3)
  Top 0.254: P1.A22 6.35,62.23 v28.57,62.23 | v28.57,36.2 33.66,36.2 36.83,33.02 IC3.2
  Bottom 0.254: v28.57,36.2 v28.57,62.23
CPUD1  (via drill 0.3)
  Top 0.254: P1.A21 6.35,59.69 v27.94,59.69 | v27.94,34.92 33.66,34.92 35.56,33.02 35.56,30.48 IC3.3
  Bottom 0.254: v27.94,34.92 v27.94,59.69
CPUD2  (via drill 0.3)
  Top 0.254: P1.A20 6.35,57.15 v27.3,57.15 | v27.3,33.66 32.38,33.66 IC3.4
  Bottom 0.254: v27.3,33.66 v27.3,57.15
CPUD3  (via drill 0.3)
  Top 0.254: v12.7,34.29 13.97,33.02 13.97,31.11 29.84,31.11 IC3.8
  Bottom 0.254: P1.A19 5.71,55.88 8.89,52.7 8.89,37.47 9.53,36.83 11.43,36.83 12.7,35.56 v12.7,34.29
CPUD4  (via drill 0.3)
  Top 0.254: v8.26,36.83 11.43,36.83 13.34,34.92 v25.4,34.92
  Bottom 0.254: P1.A18 8.26,50.16 v8.26,36.83 | v25.4,34.92 25.4,32.38 26.67,31.11 26.67,27.94 27.94,26.67 IC3.9
CPUD5  (via drill 0.3)
  Top 0.254: v7.62,34.29 11.43,34.29 13.34,32.38 13.34,30.48 v26.04,30.48
  Bottom 0.254: P1.A17 7.62,48.26 v7.62,34.29 | v26.04,30.48 26.04,26.04 27.94,24.13 IC3.11
CPUD6  (via drill 0.3)
  Top 0.254: v7.62,26.67 19.68,26.67 20.95,25.4 30.48,25.4 IC3.12
  Bottom 0.254: P1.A16 6.99,46.35 6.99,27.3 v7.62,26.67
CPUD7  (via drill 0.3)
  Top 0.254: v6.35,21.59 14.61,21.59 15.88,22.86 20.95,22.86 22.23,21.59 IC3.13
  Bottom 0.254: P1.A15 6.35,44.45 v6.35,21.59
DETECT  (via drill 0.3)
  Top 0.254: X3.DETECT 74.31,71.13 v73.34,69.53
  Bottom 0.254: R13.1 84.45,45.72 86.68,47.94 86.68,57.78 84.45,60.01 84.45,68.58 83.5,69.53 v73.34,69.53
GND  (via drill 0.3, 0.7)
  Top 0.254: IC2.22 38.1,50.8 C10.2 | IC2.2 36.83,41.91 v35.56,40.64 | C11.2 38.1,69.85 IC1.22 | v89.53,83.82 89.67,83.68 | 92.59,76.2 X3.6 | IC8.3 62.03,28.05 60.01,25.4 C21.2 | 78.42,16.61 C15.2 | IC5.18 68.44,17.96 68.58,18.41 | IC5.19 67.64,18.09 67.63,18.41 | 79.91,19.58 C19.2 | C17.2 77.15,24.13 74.93,26.35 74.5,26.55 IC8.19
  Top 0.406: IC5.5 66.84,3.65 66.99,3.17 | 67.64,3.5 IC5.6 | C14.2 78.32,9.95 79.06,9.21 C20.2
  Top 0.61: P1.A28 5.71,78.74 6.99,77.47 11.43,77.47 12.7,76.2 12.7,71.75 13.34,71.12 IC6.7 | P1.C32 14.61,88.9 15.24,89.53 C2.2 18.41,89.53 20.32,91.44 25.4,91.44 | 25.4,91.44 v25.4,90.81 | 25.4,91.44 C23.2 | QG1.7 50.16,87.63 55.24,82.55 C24.2 C25.2 v66.04,82.55 | C10.2 C1.2 v35.56,48.26 | C11.2 C3.2 | 49.53,66.67 v49.53,69.85 IC1.13 v49.53,76.2 | 49.53,66.67 IC1.12 IC2.13 IC2.12 49.53,41.91 | IC1.11 v48.26,66.67 49.53,66.67 | IC2.11 48.26,41.27 49.53,41.27 49.53,41.91 | 49.53,41.91 53.98,41.91 55.88,43.81 C29.2 58.42,46.99 U$2.11 U$2.18 | 32.38,5.71 SV1.2 | IC3.31 48.9,19.05 50.16,20.32 C5.2 | C8.2 35.56,35.56 38.1,33.02 38.1,27.3 37.47,26.67 IC3.10 30.48,27.94 27.62,27.94 26.04,27.62 v20,27.62 | v54.61,69.85 U$2.2 | 89.67,83.68 X3.3 | v89.53,76.2 92.59,76.2 | v81.28,61.59 87,61.59 U$3.GND2 v89.53,63.18 v96.52,63.18 | v73.03,35.56 R8.2 64.77,36.83 58.42,36.83 v58.42,35.24 | C21.2 v58.74,26.67 C6.2 | 78.32,19.58 C22.2 | 78.42,18.41 78.32,19.58 | v59.69,18.41 67.63,18.41 68.58,18.41 78.42,18.41 | 78.42,18.41 78.42,16.61 | 67.63,3.17 66.99,3.17 | 67.63,3.17 73.98,3.17 74.93,4.45 C18.2 | 67.63,3.17 67.64,3.5 | 78.32,19.58 79.91,19.58 | C4.2 19.37,64.77 20.64,66.04 25.72,66.04 26.99,64.77 30.48,64.77 30.8,64.45
  Top 1.016: P1.C1 17.02,10.16 C12.- | v45.09,8.89 C7.2 37.47,6.99 33.66,6.99 32.38,5.71 30.16,7.94 20.64,7.94 17.78,10.79
  Bottom 0.254: C7.2 39.37,9.53 | 53.66,12.06 53.34,12.38 | 91.44,41.77 USB1.GND@2 | USB1.GND 88.72,38.91 | U$2.18 68.58,46.99 | JP1.1 72.07,60.33 68.74,56.99
  Bottom 0.406: C13.- 17.65,21.08 | C20.2 79.06,9.21 | C32.2 56.83,49.85 56.52,49.53 56.52,45.09 C29.2
  Bottom 0.61: 3.17,78.74 P1.A28 | C12.- 17.91,10.92 | 17.65,21.08 15.88,22.86 15.88,29.21 16.51,29.84 JP2.1 IC4.10 15.56,38.1 14.61,39.05 14.61,52.39 15.24,53.02 15.24,53.34 | 15.24,53.34 IC4.4 | 15.24,53.34 14.61,53.98 14.61,57.78 15.24,58.42 IC4.2 18.41,60.33 18.41,62.23 17.78,62.87 C4.2 17.78,66.67 16.51,67.94 IC6.7 | 29.21,82.55 C28.- | 29.21,82.55 26.67,85.09 26.67,89.53 v25.4,90.81 | C8.2 v35.56,40.64 | 36.83,15.88 35.56,14.61 35.56,13.34 39.37,9.53 | 36.83,18.41 33.66,21.59 33.66,24.77 IC3.10 | 53.34,12.38 53.34,18.41 52.07,19.68 C5.2 C6.2 | v45.09,8.89 50.16,8.89 51.44,10.16 51.75,10.16 53.66,12.06 54.29,11.43 C9.2 59.05,11.43 64.45,6.03 74.93,6.03 | v49.53,69.85 v54.61,69.85 | v89.53,83.82 v89.53,76.2 v89.53,63.18 | v81.28,61.59 U$3.8 | U$3.GND1 87.85,45.72 USB1.GND@2 92.93,42.13 97.16,46.35 97.16,47.62 U$3.LEDG- 97.16,51.44 97.16,62.55 v96.52,63.18 | 91.44,41.77 USB1.GND 88.41,39.37 C26.2 C27.2 | 88.72,38.91 91.44,36.2 USB1.GND@1 | U$2.2 61.59,69.85 62.23,70.48 62.23,74.3 60.96,75.56 C30.2 60.96,80.01 62.23,81.28 C25.2 | v66.04,82.55 68.58,82.55 C16.2 | U$2.22 68.58,57.15 68.74,56.99 69.22,56.52 69.22,55.24 68.58,54.61 | 68.58,54.61 U$2.21 | 68.58,54.61 69.22,53.98 69.22,47.62 68.58,46.99 | 29.21,82.55 27.3,80.64 27.3,78.74 27.94,78.11 29.84,78.11 30.48,77.47 30.48,71.12 C11.2 | U$2.18 69.85,46.99 71.75,45.09 71.75,40.64 C27.2 | C27.2 v73.03,35.56 73.66,34.92 73.66,29.53 78.11,24.13 C17.2 | v58.74,26.67 58.74,34.61 58.42,34.92 v58.42,35.24 | C21.2 59.69,23.5 v59.69,18.41 | R7.1 R6.1 77.79,3.49 C18.2 76.2,6.35 79.06,9.21 | C20.2 80.64,19.05 C19.2 80.01,23.81 79.69,24.13
  Bottom 0.61: C3.2 30.8,66.36 v30.8,64.77 30.8,63.5 30.48,63.18 30.48,52.07 C10.2 | v20,27.62 20,21.91 19.37,21.27 18.1,21.27 17.78,20.95
  Bottom 0.813: P1.C1 P1.A1 3.17,10.16 1.91,11.43 1.91,77.47 3.17,78.74 | P1.A28 P1.A29 P1.A30 P1.A31 P1.A32 P1.C32 | 17.91,10.92 19.68,12.7 19.68,19.18 C13.-
  pour Bottom (isolate 0.61): 1.91,98.11 98.11,98.11 98.11,1.59 1.91,1.59
H12MHZ
  Top 0.254: IC1.6 41.91,66.67 42.55,67.31 42.55,85.09 45.72,88.27 45.72,91.44 QG1.8
HMISO0
  Top 0.254: IC2.3 38.1,34.29 39.37,33.02 IC3.44
HMISO1
  Top 0.254: IC2.4 39.37,39.37 38.73,38.73 38.73,34.92 40.64,33.02 40.64,30.48 IC3.43
HMISO2  (via drill 0.3)
  Top 0.254: v40.64,39.37 IC2.5 | v43.18,39.37 43.18,27.94 IC3.38
  Bottom 0.254: v43.18,39.37 v40.64,39.37
HMISO3  (via drill 0.3)
  Top 0.254: v41.91,40.01 IC2.6
  Bottom 0.254: v41.91,40.01 48.26,40.01 48.26,27.94 IC3.37
HMOSI  (via drill 0.3)
  Top 0.254: IC1.3 38.1,57.78 38.73,57.15 v38.73,40.64
  Bottom 0.254: v38.73,40.64 48.9,40.64 48.9,26.04 IC3.35
HSCLK  (via drill 0.3)
  Top 0.254: v39.37,60.96 IC1.4 | v38.1,22.23 38.73,21.59 IC3.34
  Bottom 0.254: v39.37,60.96 36.83,58.42 36.83,55.88 36.51,55.56 36.51,50.16 36.83,49.85 36.83,36.2 38.1,34.92 v38.1,22.23
LEDY+  (via drill 0.3)
  Top 0.254: v93.66,65.09 81.28,65.09 80.64,65.72 75.88,65.72 JP1.4
  Bottom 0.254: U$3.LEDY+ 93.66,58.74 v93.66,65.09
LEDY-  (via drill 0.3)
  Top 0.254: v95.25,64.14 82.55,64.14 81.28,63.18 75.88,63.18 JP1.3
  Bottom 0.254: v95.25,64.14 U$3.LEDY-
MISO0  (via drill 0.3)
  Top 0.254: v52.7,59.69 U$2.6 | R18.2 39.37,58.1 IC2.21
  Bottom 0.254: v52.7,59.69 40.96,59.69 R18.2
MISO1  (via drill 0.3)
  Top 0.254: IC2.20 40.64,56.83 v41.91,58.1 | v88.27,73.66 92.59,73.66 X3.7 | v52.7,58.42 68.58,58.42 69.85,59.69 77.47,59.69 80.33,62.55 85.09,62.55 v85.72,63.18
  Bottom 0.254: v41.91,58.1 42.23,58.42 42.55,58.42 v52.7,58.42 | v85.72,63.18 85.72,71.12 v88.27,73.66
MISO2  (via drill 0.3)
  Top 0.254: v41.91,48.58 IC2.19 | v50.48,48.58 50.8,48.26 v63.5,48.26 | v63.5,31.75 57.78,31.75 v57.15,31.43 | v57.15,19.68 67.94,19.68 68.26,20 68.26,23.79 IC8.15
  Bottom 0.254: v50.48,48.58 v41.91,48.58 | v63.5,31.75 v63.5,48.26 | v57.15,19.68 v57.15,31.43
MISO3  (via drill 0.3)
  Top 0.254: v43.18,50.8 IC2.18 | v51.44,50.16 52.7,50.16 53.34,50.8 55.56,50.8 56.2,51.44 57.78,51.44 58.42,50.8 v64.14,50.8 | IC5.13 73.83,10.96 v74.61,11.11
  Bottom 0.254: v43.18,50.8 45.09,50.8 45.72,50.16 v51.44,50.16 | v64.14,50.8 64.14,38.73 65.09,38.1 70.48,38.1 70.48,33.02 71.75,31.75 71.75,19.37 74.61,16.19 v74.61,11.11
MOSI  (via drill 0.3)
  Top 0.254: v39.37,67.94 IC1.21 | v53.34,57.15 U$2.7 | v88.9,86.36 90.35,86.18 X3.2 | v72.84,86.18 69.35,86.18 68.58,85.41 68.58,81.92 66.04,79.38 60.01,79.38 58.1,77.47 53.34,77.47 v53.34,67.94 | IC8.16 68.74,20.48 69.69,19.53 v69.85,19.37 | IC5.14 v73.33,11.76 v73.34,11.75 | v69.85,19.37 | v54.61,19.37 54.93,19.37 55.24,19.05 68.58,19.05 68.9,19.37 v69.85,19.37
  Bottom 0.254: v39.37,67.94 v53.34,67.94 v53.34,57.15 53.34,46.99 52.7,46.35 52.7,33.02 54.61,31.11 v54.61,19.37 | v72.84,86.18 v88.9,86.36 | v73.34,11.75 73.34,15.56 v69.85,19.37
N8PHI2  (via drill 0.3)
  Top 0.254: v27.94,76.2 IC6.10
  Bottom 0.254: IC3.6 31.75,34.92 29.84,36.83 29.84,63.5 27.94,65.41 v27.94,76.2
N$1  (via drill 0.3)
  Top 0.254: v14.61,24.77 12.06,24.77 11.43,24.13 8.89,24.13 7.62,25.4 P1.A7
  Bottom 0.254: IC4.1 15.24,60.96 13.97,59.69 13.97,38.1 15.24,36.83 15.24,35.56 14.61,34.92 v14.61,24.77
N$3
  Top 0.254: IC8.20 75.18,27.05 76.83,26.99 77.86,27.05 79.69,28.57 R3.1
N$4
  Top 0.254: IC8.21 76.27,27.55 77.15,27.62 77.08,27.55 79.69,29.84 83.19,29.84 R2.1
N$5  (via drill 0.3)
  Top 0.406: IC5.20 66.84,17.31 v66.99,17.46 | v71.44,16.51 73.66,16.51 75.25,14.92 80.64,14.92 81.28,15.56 81.28,21.91 83.5,24.13 86.36,24.13 R5.1
  Bottom 0.406: v66.99,17.46 66.99,16.83 67.31,16.51 v71.44,16.51
N$6  (via drill 0.3)
  Top 0.406: IC5.21 v66.04,17.46 | v71.75,15.56 73.66,15.56 74.93,14.29 81.28,14.29 82.23,15.24 82.23,21.27 R4.1
  Bottom 0.406: v66.04,17.46 66.04,16.19 66.67,15.56 v71.75,15.56
N$7  (via drill 0.3)
  Top 0.406: R4.2 85.09,15.24 90.17,20.32 USB2.D+ | v90.49,9.21 91.76,9.21 92.08,8.89 X1.D+
  Bottom 0.406: v90.49,9.21 88.9,9.21 87,11.11 87,13.02 84.77,15.24 R4.2
N$8  (via drill 0.3)
  Top 0.406: X1.D- 93.01,9.54 92.39,10.16 v91.44,10.16
  Bottom 0.406: 91.12,15.24 R5.2 | 91.12,15.24 93.34,15.24 93.98,15.88 93.98,18.16 USB2.D- | v91.44,10.16 91.44,14.92 91.12,15.24
N$9
  Bottom 0.254: R2.2 84.45,34.29 86.68,36.51 88.14,36.51 USB1.D+
N$10
  Bottom 0.254: R3.2 80.96,34.29 82.23,33.02 85.41,33.02 86.68,34.29 88.46,34.29 USB1.D-
N$11  (via drill 0.3)
  Top 0.254: IC8.26 68.24,32.05 68.26,32.07 74.3,32.07 v74.93,31.43
  Bottom 0.254: v74.93,31.43 74.3,32.07 74.3,33.02 74.93,33.66 77.15,33.66 80.96,37.47 82.55,37.47 83.82,36.2 R13.2
N$13
  Top 0.406: X1.GND 90.83,7.59 89.22,9.21 R7.2
  Bottom 0.406: USB2.GND 90.82,21.92 86.04,17.14 86.04,14.92 87.31,13.65 89.22,13.65 R7.2
N$14  (via drill 0.3)
  Top 0.254: IC8.27 67.74,32.18 68.26,32.7 v75.25,32.7
  Bottom 0.254: v75.25,32.7 77.15,32.7 80.96,36.2 R14.2
N$15
  Top 0.254: IC4.8 IC4.13 26.04,43.18 26.67,43.81 26.67,46.35 26.04,46.99 20.95,46.99 19.68,48.26 IC4.6
  Bottom 0.254: IC4.8 17.78,43.18 19.05,41.91 JP2.2
N$16
  Bottom 0.61: USB2.GND@2 USB2.GND@1 96.05,16.67 92.39,13.02 92.39,6.99 92.08,6.67 90.17,6.67 R6.2 80.96,6.35 C18.1
N$17
  Top 0.254: U$2.27 70.17,72.71 R15.2
N$18
  Top 0.254: U$2.26 68.58,67.31 69.22,67.94 69.22,70.17 R16.2
N$19
  Top 0.254: R16.1 72.71,76.52 74.3,74.93 74.3,72.71 72.71,71.12 72.07,70.17 JP1.2
  Bottom 0.254: JP1.2 73.34,63.18 75.88,63.18 JP1.5
N$20  (via drill 0.3)
  Top 0.254: v64.14,59.69 U$2.23
  Bottom 0.254: Q3.2 63.37,91.95 62.23,90.81 C25.1 64.14,85.72 v64.14,59.69
N$21  (via drill 0.3)
  Top 0.254: v63.18,74.93 R17.2 | v63.18,62.23 U$2.24
  Bottom 0.254: v63.18,62.23 v63.18,74.93
N$22
  Bottom 0.254: Q3.1 58.55,91.57 57.15,90.17 C24.1 56.83,87.63 55.88,86.68 55.88,81.28 R17.1
N$23
  Bottom 0.254: R8.1 59.69,36.83 U$2.14
N$30
  Bottom 0.254: C28.+ 49.91,80.26 57.78,72.39 U$2.1
N$31  (via drill 0.3)
  Top 0.254: v92.08,66.04 81.6,66.04 80.96,66.67 v73.03,66.67
  Bottom 0.254: U$3.LEDG+ 94.61,46.99 93.03,48.58 93.03,63.5 92.08,64.45 v92.08,66.04 | v73.03,66.67 69.22,66.67 69.22,75.25 70.17,76.2 R15.1
NPHI2  (via drill 0.3)
  Top 0.254: IC6.12 24.77,81.28 27.94,78.11 v34.29,78.11
  Bottom 0.254: v34.29,78.11 34.29,34.29 35.56,33.02 35.56,30.48 IC3.5
SCLK  (via drill 0.3)
  Top 0.254: v40.64,68.58 IC1.20 | v53.98,54.61 U$2.8 | v53.98,68.58 53.98,76.83 58.42,76.83 60.33,78.74 67.94,78.74 68.9,79.38 v76.52,79.38 | v88.27,79.38 88.9,78.74 92.55,78.74 X3.5 | IC8.13 67.24,21.2 66.99,20.95 v55.24,20.95 | v73.98,8.89 73.66,9.21 | v73.98,8.89 74.14,8.72 | IC5.11 73.51,9.36 v73.98,8.89
  Bottom 0.254: v40.64,68.58 v53.98,68.58 v53.98,54.61 53.98,46.99 53.34,46.35 53.34,33.66 55.24,31.75 v55.24,20.95 55.24,15.24 57.78,12.38 59.37,12.38 62.55,9.53 73.34,9.53 v73.98,8.89 | v76.52,79.38 v88.27,79.38
TCK
  Bottom 0.254: SV1.3 29.84,10.16 29.21,10.79 IC3.17
TDI
  Bottom 0.254: IC3.15 27.94,17.78 27.94,10.79 24.77,7.62 SV1.5
TDO
  Bottom 0.254: SV1.4 27.3,2.54 27.94,1.91 36.2,1.91 46.35,12.06 46.35,14.61 IC3.30
TMS  (via drill 0.7)
  Top 0.254: v27.3,19.05 28.57,20.32 30.48,20.32 IC3.16
  Bottom 0.254: SV1.6 22.23,6.35 27.3,11.43 v27.3,19.05
TPIN0
  Bottom 0.406: R12.1 R11.2 | R12.1 71.75,52.7 71.75,48.26 73.03,46.99 C27.1 | R12.1 75.25,53.98 76.52,55.24 79.06,55.24 80.33,53.98 U$3.5
TPIN+
  Top 0.406: U$2.13 61.59,41.91 62.87,43.18 68.9,43.18 69.22,43.5 69.22,45.4 71.12,47.31 71.12,51.44 72.39,52.7 74.93,52.7 76.2,53.98 R12.2
  Bottom 0.254: R12.2 78.74,53.98
  Bottom 0.406: 78.74,53.98 79.06,53.98 80.33,52.7 U$3.4
TPIN-
  Top 0.406: U$2.12 61.59,44.45 62.87,45.72 68.58,45.72 70.48,47.62 70.48,53.98 71.75,55.24 74.93,55.24 76.2,56.52 R11.1
  Bottom 0.254: R11.1 78.74,56.52
  Bottom 0.406: 78.74,56.52 79.38,56.52 80.64,55.24 U$3.6
TPOUT0
  Top 0.406: J1.2 77.79,36.2 79.38,37.78 79.38,42.55 C26.1
  Bottom 0.406: U$3.2 74.3,50.16 R9.1 | R9.1 R10.2 | C26.1 R9.1
TPOUT+  (via drill 0.3)
  Top 0.406: v70.8,44.45 73.34,46.99 76.2,46.99 R9.2
  Bottom 0.406: R9.2 U$3.1 | U$2.17 v70.8,44.45
TPOUT-
  Top 0.406: U$2.16 69.22,41.91 69.85,42.55 69.85,44.77 72.71,47.62 74.93,47.62 76.2,48.9 76.2,50.16 77.47,51.44 R10.1
  Bottom 0.406: R10.1 U$3.3
VBCOMP  (via drill 0.3)
  Top 0.406: IC5.24 63.64,17.32 v63.5,17.46 | 89.22,14.29 88.58,13.65 77.79,13.65 v77.47,13.34 77.15,13.65 74.61,13.65 73.66,14.61 v71.44,14.61 70.48,15.56 70.48,16.83 71.12,17.46 74.3,17.46 75.25,16.51 C15.1 | 89.22,14.29 89.85,14.92 89.85,17.15 USB2.VBUS | X1.VBUS 93.31,10.19 89.22,14.29
  Bottom 0.406: v63.5,17.46 64.77,15.88 65.72,14.61 v71.44,14.61 | C19.1 75.88,19.68 76.52,19.05 76.52,13.97 v77.47,13.34
VCC  (via drill 0.3, 0.7)
  Top 0.254: 35.24,60.96 36.83,60.96 IC1.2 | v21.59,14.61 21.91,14.61
  Top 0.406: 35.24,60.96 35.56,61.28
  Top 0.61: 21.46,14.48 v21.59,14.61 | IC4.15 26.04,48.26 27.94,46.35 27.94,44.45 29.21,43.18 C1.1 33.66,43.18 34.29,42.55 | IC2.1 35.56,42.55 34.29,42.55 | IC6.14 25.4,86.36 C23.1 | C23.1 QG1.14 | C23.1 31.75,90.17 QG1.1 | 35.24,60.96 33.02,60.96 C3.1 30.48,60.96 IC4.20 | IC3.41 44.45,29.84 47.62,33.02 50.8,33.02 C6.1 52.7,31.75 55.24,34.29 76.83,34.29 79.38,31.75 88.41,31.75 USB1.VBUS | IC3.32 42.55,19.05 41.27,17.78 35.56,17.78 IC3.21 | 34.29,42.55 34.29,40.01 35.56,38.73 v37.47,38.73 | 21.91,14.61 25.72,10.79 v34.29,10.79 v49.85,10.79 | 35.56,61.28 IC1.1
  Top 1.016: P1.C2 P1.C3 17.02,15.24 C12.+ 21.46,14.48
  Bottom 0.254: 21.59,33.66 JP2.3 | IC4.20 24.13,61.59 | 23.5,53.34 IC4.17 | 23.5,48.26 IC4.15 | IC4.11 23.5,38.1
  Bottom 0.61: R1.1 24.13,92.08 22.86,90.81 C2.1 24.13,88.27 IC6.14 22.86,86.36 20.32,83.82 20.32,71.12 22.86,68.58 C4.1 22.86,62.87 24.13,61.59 | v21.59,14.61 21.59,33.66 21.59,35.56 IC4.11 | IC4.20 23.5,60.96 22.23,59.69 22.23,54.61 23.5,53.34 22.23,52.07 22.23,49.53 23.5,48.26 22.23,46.99 22.23,39.37 23.5,38.1 | C5.1 50.8,16.51 49.21,16.51 47.94,17.78 45.72,17.78 IC3.32 43.18,20.32 43.18,27.3 44.45,28.57 IC3.41 | v34.29,10.79 C7.1 34.29,6.99 34.92,6.35 SV1.1 | v37.47,38.73 39.37,36.83 C8.1 | C6.1 52.07,29.84 50.8,28.57 50.8,25.72 51.12,25.4 51.12,21.27 50.48,20.64 50.48,18.41 50.8,18.1 51.12,18.1 52.07,17.14 C5.1 | v49.85,10.79 49.85,13.02 C5.1
WPROT  (via drill 0.3)
  Top 0.254: X3.WRITE_PROT 73.58,68.03 v73.34,68.58
  Bottom 0.254: R14.1 81.6,45.4 82.87,46.67 84.45,46.67 86.04,48.26 86.04,57.47 83.82,59.69 83.82,67.63 82.87,68.58 v73.34,68.58

### Text on the board
Top: (C) A. Fachat | CSA-NETUSB-V2.0B
tPlace: (C) A. Fachat | CSA-NETUSB-V2.0B